# EAGLE design led-matrix-cape (EAGLE 6.6.0)

## Sheet 1 of 5
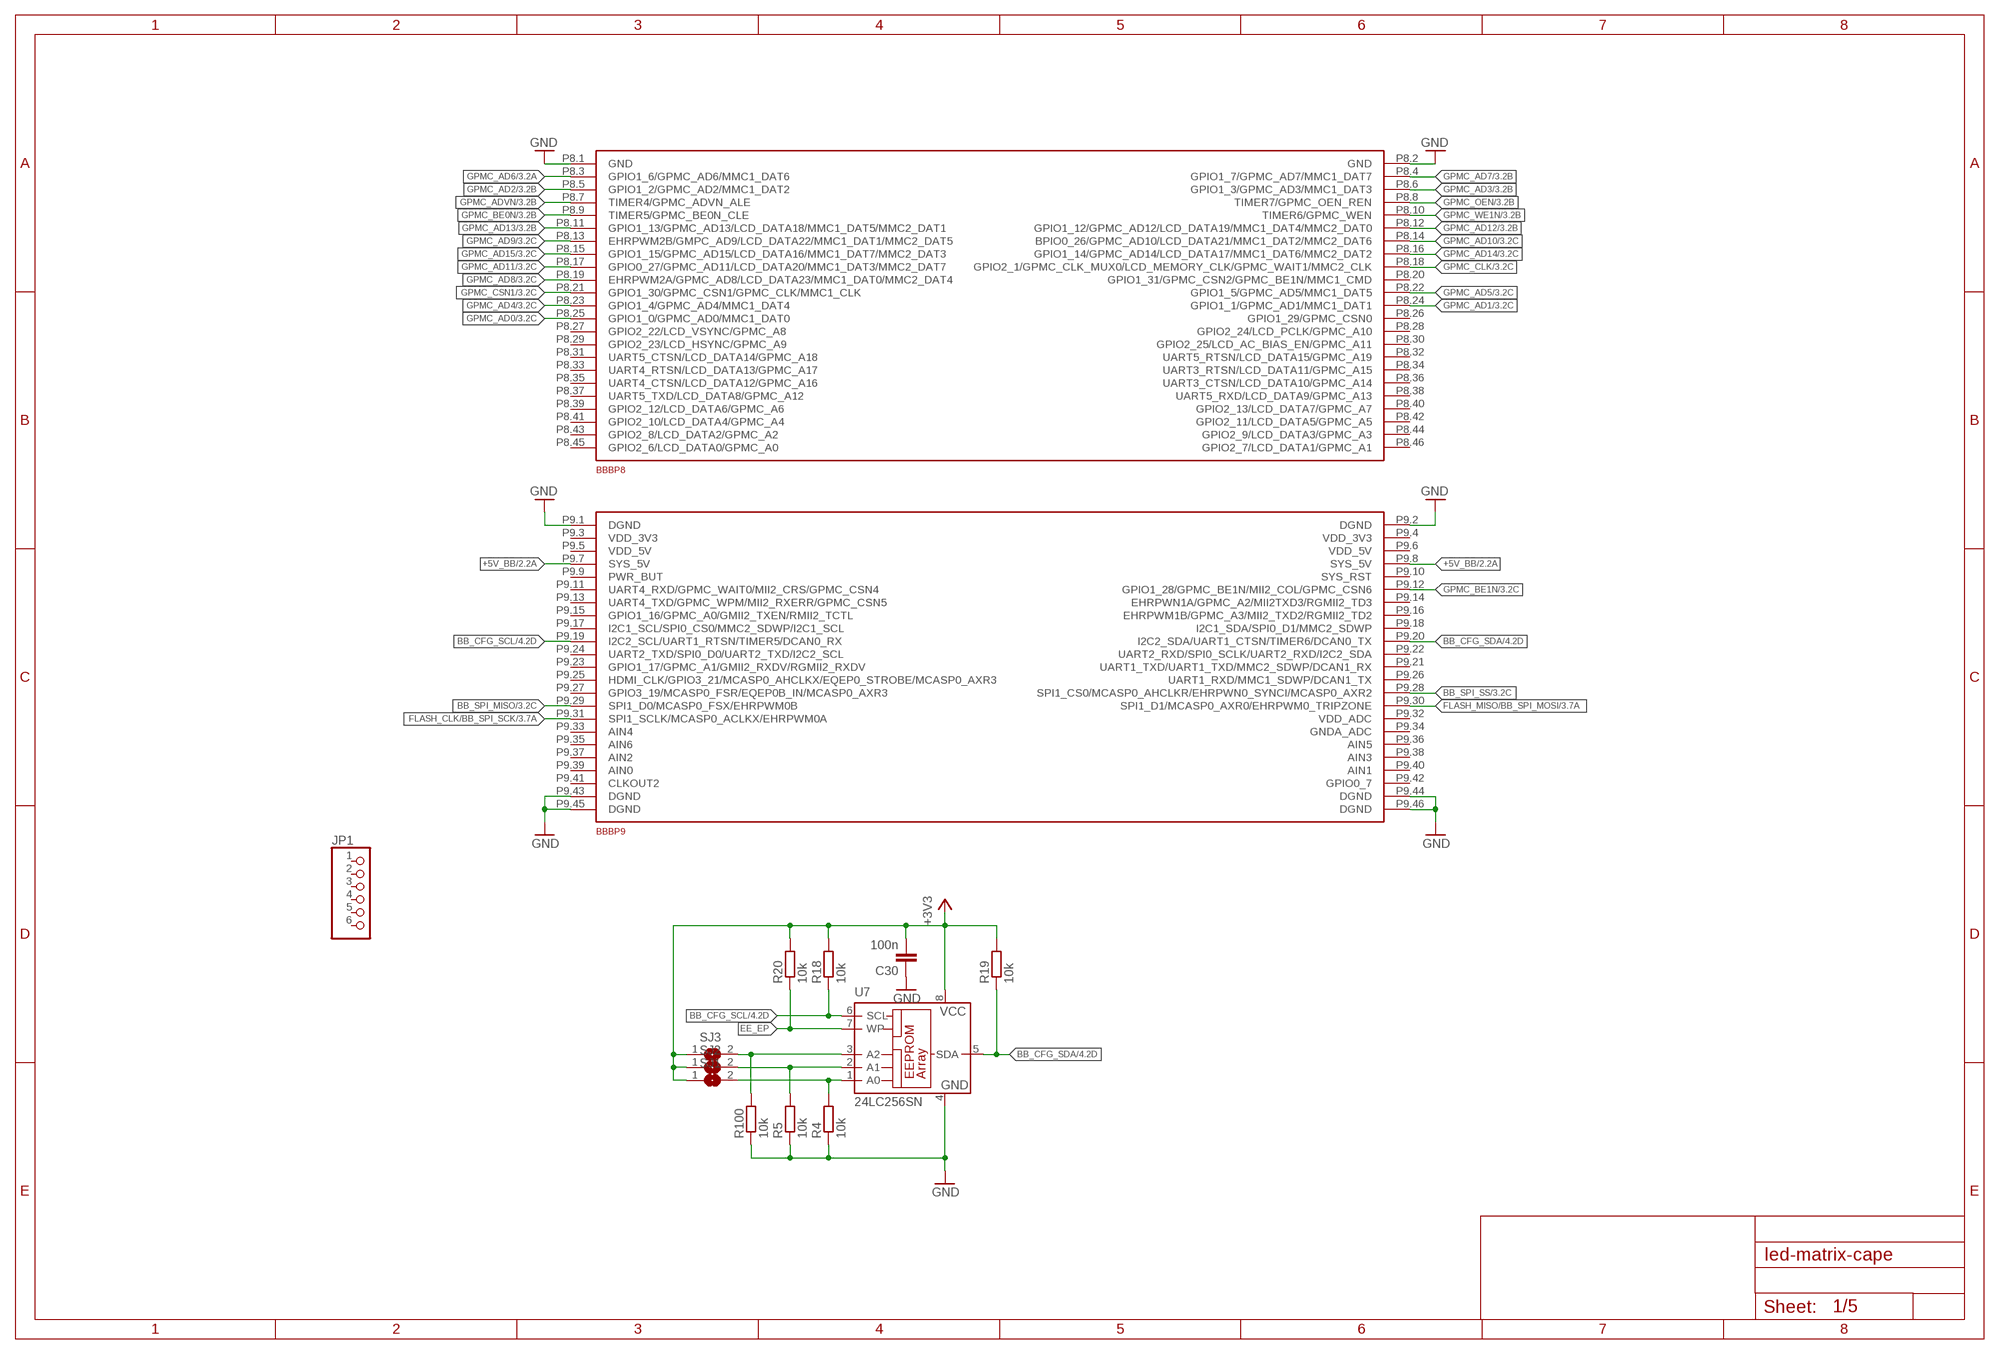
[diagram p0: schematic, sheet 1]

### Parts
BBB  BEAGLEBONE_CAPE_CONNECTORS  [BEAGLEBONE_CAPE]
C30  100n  C-EUC0603  [C0603]
JP1  PINHD-1X6  [1X06]
R4  10k  R-EU_R0603  [R0603]
R5  10k  R-EU_R0603  [R0603]
R18  10k  R-EU_R0603  [R0603]
R19  10k  R-EU_R0603  [R0603]
R20  10k  R-EU_R0603  [R0603]
R100  10k  R-EU_R0603  [R0603]
SJ1  SJ  [SJ]
SJ2  SJ  [SJ]
SJ3  SJ  [SJ]
U7  24LC256SN  [SO-08]

### Nets
+3V3: C30.2 R18.2 R19.2 R20.2 SJ1.1 SJ2.1 SJ3.1 U7.8(VCC) ; also sheet 2,3,4,5
+5V_BB: BBB.P9.7(P9:SYS_5V) BBB.P9.8(P9:SYS_5V) ; also sheet 2
ADDR0: R4.2 SJ1.2 U7.1(A0)
ADDR1: R5.2 SJ2.2 U7.2(A1)
ADDR2: R100.2 SJ3.2 U7.3(A2)
BB_CFG_SCL: BBB.P9.19(P9:I2C2_SCL/UART1_RTSN/TIMER5/DCAN0_RX) R18.1 U7.6(SCL) ; also sheet 4
BB_CFG_SDA: BBB.P9.20(P9:I2C2_SDA/UART1_CTSN/TIMER6/DCAN0_TX) R19.1 U7.5(SDA) ; also sheet 4
BB_SPI_MISO: BBB.P9.29(P9:SPI1_D0/MCASP0_FSX/EHRPWM0B) ; also sheet 3
BB_SPI_SS: BBB.P9.28(P9:SPI1_CS0/MCASP0_AHCLKR/EHRPWN0_SYNCI/MCASP0_AXR2) ; also sheet 3
EE_EP: R20.1 U7.7(WP)
FLASH_CLK/BB_SPI_SCK: BBB.P9.31(P9:SPI1_SCLK/MCASP0_ACLKX/EHRPWM0A) ; also sheet 3,4
FLASH_MISO/BB_SPI_MOSI: BBB.P9.30(P9:SPI1_D1/MCASP0_AXR0/EHRPWM0_TRIPZONE) ; also sheet 3,4
GND: BBB.P8.1(P8:GND) BBB.P8.2(P8:GND) BBB.P9.1(P9:DGND) BBB.P9.2(P9:DGND) BBB.P9.43(P9:DGND) BBB.P9.44(P9:DGND) BBB.P9.45(P9:DGND) BBB.P9.46(P9:DGND) C30.1 R4.1 R5.1 R100.1 U7.4(GND) ; also sheet 2,3,4,5
GPMC_AD0: BBB.P8.25(P8:GPIO1_0/GPMC_AD0/MMC1_DAT0) ; also sheet 3
GPMC_AD1: BBB.P8.24(P8:GPIO1_1/GPMC_AD1/MMC1_DAT1) ; also sheet 3
GPMC_AD2: BBB.P8.5(P8:GPIO1_2/GPMC_AD2/MMC1_DAT2) ; also sheet 3
GPMC_AD3: BBB.P8.6(P8:GPIO1_3/GPMC_AD3/MMC1_DAT3) ; also sheet 3
GPMC_AD4: BBB.P8.23(P8:GPIO1_4/GPMC_AD4/MMC1_DAT4) ; also sheet 3
GPMC_AD5: BBB.P8.22(P8:GPIO1_5/GPMC_AD5/MMC1_DAT5) ; also sheet 3
GPMC_AD6: BBB.P8.3(P8:GPIO1_6/GPMC_AD6/MMC1_DAT6) ; also sheet 3
GPMC_AD7: BBB.P8.4(P8:GPIO1_7/GPMC_AD7/MMC1_DAT7) ; also sheet 3
GPMC_AD8: BBB.P8.19(P8:EHRPWM2A/GPMC_AD8/LCD_DATA23/MMC1_DAT0/MMC2_DAT4) ; also sheet 3
GPMC_AD9: BBB.P8.13(P8:EHRPWM2B/GMPC_AD9/LCD_DATA22/MMC1_DAT1/MMC2_DAT5) ; also sheet 3
GPMC_AD10: BBB.P8.14(P8:BPIO0_26/GPMC_AD10/LCD_DATA21/MMC1_DAT2/MMC2_DAT6) ; also sheet 3
GPMC_AD11: BBB.P8.17(P8:GPIO0_27/GPMC_AD11/LCD_DATA20/MMC1_DAT3/MMC2_DAT7) ; also sheet 3
GPMC_AD12: BBB.P8.12(P8:GPIO1_12/GPMC_AD12/LCD_DATA19/MMC1_DAT4/MMC2_DAT0) ; also sheet 3
GPMC_AD13: BBB.P8.11(P8:GPIO1_13/GPMC_AD13/LCD_DATA18/MMC1_DAT5/MMC2_DAT1) ; also sheet 3
GPMC_AD14: BBB.P8.16(P8:GPIO1_14/GPMC_AD14/LCD_DATA17/MMC1_DAT6/MMC2_DAT2) ; also sheet 3
GPMC_AD15: BBB.P8.15(P8:GPIO1_15/GPMC_AD15/LCD_DATA16/MMC1_DAT7/MMC2_DAT3) ; also sheet 3
GPMC_ADVN: BBB.P8.7(P8:TIMER4/GPMC_ADVN_ALE) ; also sheet 3
GPMC_BE0N: BBB.P8.9(P8:TIMER5/GPMC_BE0N_CLE) ; also sheet 3
GPMC_BE1N: BBB.P9.12(P9:GPIO1_28/GPMC_BE1N/MII2_COL/GPMC_CSN6) ; also sheet 3
GPMC_CLK: BBB.P8.18(P8:GPIO2_1/GPMC_CLK_MUX0/LCD_MEMORY_CLK/GPMC_WAIT1/MMC2_CLK) ; also sheet 3
GPMC_CSN1: BBB.P8.21(P8:GPIO1_30/GPMC_CSN1/GPMC_CLK/MMC1_CLK) ; also sheet 3
GPMC_OEN: BBB.P8.8(P8:TIMER7/GPMC_OEN_REN) ; also sheet 3
GPMC_WE1N: BBB.P8.10(P8:TIMER6/GPMC_WEN) ; also sheet 3
Unconnected: BBB.P8.20(P8:GPIO1_31/GPMC_CSN2/GPMC_BE1N/MMC1_CMD) BBB.P8.26(P8:GPIO1_29/GPMC_CSN0) BBB.P8.27(P8:GPIO2_22/LCD_VSYNC/GPMC_A8) BBB.P8.28(P8:GPIO2_24/LCD_PCLK/GPMC_A10) BBB.P8.29(P8:GPIO2_23/LCD_HSYNC/GPMC_A9) BBB.P8.30(P8:GPIO2_25/LCD_AC_BIAS_EN/GPMC_A11) BBB.P8.31(P8:UART5_CTSN/LCD_DATA14/GPMC_A18) BBB.P8.32(P8:UART5_RTSN/LCD_DATA15/GPMC_A19) BBB.P8.33(P8:UART4_RTSN/LCD_DATA13/GPMC_A17) BBB.P8.34(P8:UART3_RTSN/LCD_DATA11/GPMC_A15) BBB.P8.35(P8:UART4_CTSN/LCD_DATA12/GPMC_A16) BBB.P8.36(P8:UART3_CTSN/LCD_DATA10/GPMC_A14) BBB.P8.37(P8:UART5_TXD/LCD_DATA8/GPMC_A12) BBB.P8.38(P8:UART5_RXD/LCD_DATA9/GPMC_A13) BBB.P8.39(P8:GPIO2_12/LCD_DATA6/GPMC_A6) BBB.P8.40(P8:GPIO2_13/LCD_DATA7/GPMC_A7) BBB.P8.41(P8:GPIO2_10/LCD_DATA4/GPMC_A4) BBB.P8.42(P8:GPIO2_11/LCD_DATA5/GPMC_A5) BBB.P8.43(P8:GPIO2_8/LCD_DATA2/GPMC_A2) BBB.P8.44(P8:GPIO2_9/LCD_DATA3/GPMC_A3) BBB.P8.45(P8:GPIO2_6/LCD_DATA0/GPMC_A0) BBB.P8.46(P8:GPIO2_7/LCD_DATA1/GPMC_A1) BBB.P9.3(P9:VDD_3V3) BBB.P9.4(P9:VDD_3V3) BBB.P9.5(P9:VDD_5V) BBB.P9.6(P9:VDD_5V) BBB.P9.9(P9:PWR_BUT) BBB.P9.10(P9:SYS_RST) BBB.P9.11(P9:UART4_RXD/GPMC_WAIT0/MII2_CRS/GPMC_CSN4) BBB.P9.13(P9:UART4_TXD/GPMC_WPM/MII2_RXERR/GPMC_CSN5) BBB.P9.14(P9:EHRPWN1A/GPMC_A2/MII2TXD3/RGMII2_TD3) BBB.P9.15(P9:GPIO1_16/GPMC_A0/GMII2_TXEN/RMII2_TCTL) BBB.P9.16(P9:EHRPWM1B/GPMC_A3/MII2_TXD2/RGMII2_TD2) BBB.P9.17(P9:I2C1_SCL/SPI0_CS0/MMC2_SDWP/I2C1_SCL) BBB.P9.18(P9:I2C1_SDA/SPI0_D1/MMC2_SDWP) BBB.P9.21(P9:UART1_TXD/UART1_TXD/MMC2_SDWP/DCAN1_RX) BBB.P9.22(P9:UART2_RXD/SPI0_SCLK/UART2_RXD/I2C2_SDA) BBB.P9.23(P9:GPIO1_17/GPMC_A1/GMII2_RXDV/RGMII2_RXDV) BBB.P9.24(P9:UART2_TXD/SPI0_D0/UART2_TXD/I2C2_SCL) BBB.P9.25(P9:HDMI_CLK/GPIO3_21/MCASP0_AHCLKX/EQEP0_STROBE/MCASP0_AXR3) BBB.P9.26(P9:UART1_RXD/MMC1_SDWP/DCAN1_TX) BBB.P9.27(P9:GPIO3_19/MCASP0_FSR/EQEP0B_IN/MCASP0_AXR3) BBB.P9.32(P9:VDD_ADC) BBB.P9.33(P9:AIN4) BBB.P9.34(P9:GNDA_ADC) BBB.P9.35(P9:AIN6) BBB.P9.36(P9:AIN5) BBB.P9.37(P9:AIN2) BBB.P9.38(P9:AIN3) BBB.P9.39(P9:AIN0) BBB.P9.40(P9:AIN1) BBB.P9.41(P9:CLKOUT2) BBB.P9.42(P9:GPIO0_7) JP1.1 JP1.2 JP1.3 JP1.4 JP1.5 JP1.6

## Sheet 2 of 5
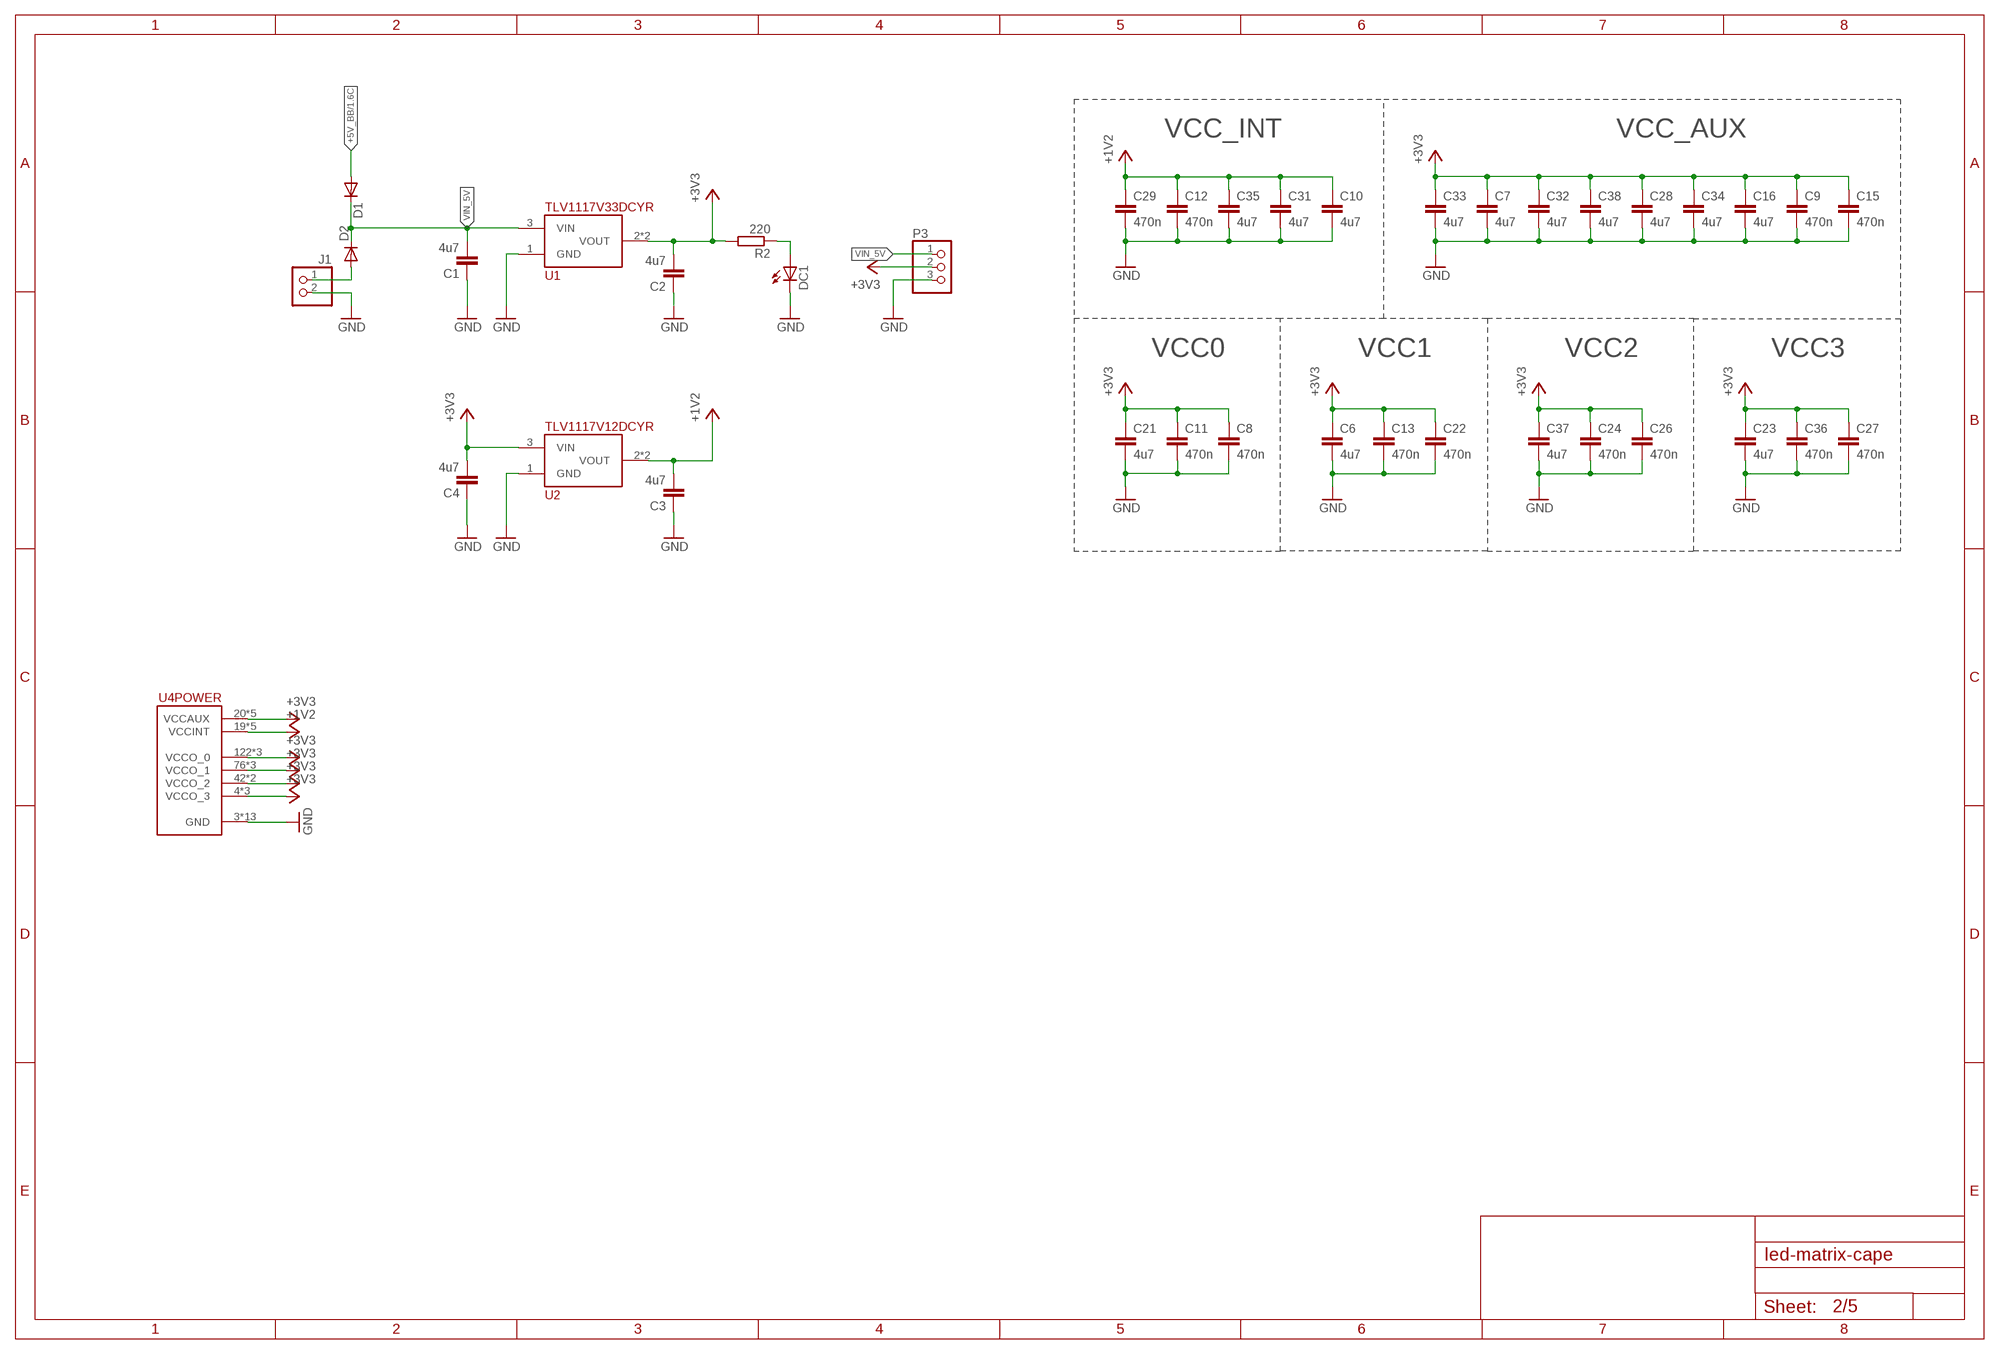
[diagram p1: schematic, sheet 2]

### Parts
C1  4u7  C-EUC0603  [C0603]
C2  4u7  C-EUC0603  [C0603]
C3  4u7  C-EUC0603  [C0603]
C4  4u7  C-EUC0603  [C0603]
C6  4u7  C-EUC0603  [C0603]
C7  4u7  C-EUC0603  [C0603]
C8  470n  C-EUC0603  [C0603]
C9  470n  C-EUC0603  [C0603]
C10  4u7  C-EUC0603  [C0603]
C11  470n  C-EUC0603  [C0603]
C12  470n  C-EUC0603  [C0603]
C13  470n  C-EUC0603  [C0603]
C15  470n  C-EUC0603  [C0603]
C16  4u7  C-EUC0603  [C0603]
C21  4u7  C-EUC0603  [C0603]
C22  470n  C-EUC0603  [C0603]
C23  4u7  C-EUC0603  [C0603]
C24  470n  C-EUC0603  [C0603]
C26  470n  C-EUC0603  [C0603]
C27  470n  C-EUC0603  [C0603]
C28  4u7  C-EUC0603  [C0603]
C29  470n  C-EUC0603  [C0603]
C31  4u7  C-EUC0603  [C0603]
C32  4u7  C-EUC0603  [C0603]
C33  4u7  C-EUC0603  [C0603]
C34  4u7  C-EUC0603  [C0603]
C35  4u7  C-EUC0603  [C0603]
C36  470n  C-EUC0603  [C0603]
C37  4u7  C-EUC0603  [C0603]
C38  4u7  C-EUC0603  [C0603]
D1  DIODE-SOD123  [SOD123]
D2  DIODE-SOD123  [SOD123]
DC1  LEDCHIP-LED0805  [CHIP-LED0805]
J1  PINHD-1X2  [1X02]
P3  PINHD-1X3  [1X03]
R2  220  R-EU_R0805  [R0805]
U1  TLV1117V33DCYR  TLV1117V  [SOT223]
U2  TLV1117V12DCYR  TLV1117V  [SOT223]
U4  XC6SLX9-2TQG144C  [TQFP144]

### Nets
+1V2: C3.2 C10.1 C12.1 C29.1 C31.1 C35.1 U2.2(VOUT) U2.4(VOUT) U4.19(POWER:VCCINT) U4.28(POWER:VCCINT) U4.52(POWER:VCCINT) U4.89(POWER:VCCINT) U4.128(POWER:VCCINT)
+3V3: C2.2 C4.2 C6.1 C7.1 C8.1 C9.1 C11.1 C13.1 C15.1 C16.1 C21.1 C22.1 C23.1 C24.1 C26.1 C27.1 C28.1 C32.1 C33.1 C34.1 C36.1 C37.1 C38.1 P3.2 R2.2 U1.2(VOUT) U1.4(VOUT) U2.3(VIN) U4.4(POWER:VCCO_3) U4.18(POWER:VCCO_3) U4.20(POWER:VCCAUX) U4.31(POWER:VCCO_3) U4.36(POWER:VCCAUX) U4.42(POWER:VCCO_2) U4.53(POWER:VCCAUX) U4.63(POWER:VCCO_2) U4.76(POWER:VCCO_1) U4.86(POWER:VCCO_1) U4.90(POWER:VCCAUX) U4.103(POWER:VCCO_1) U4.122(POWER:VCCO_0) U4.125(POWER:VCCO_0) U4.129(POWER:VCCAUX) U4.135(POWER:VCCO_0) ; also sheet 1,3,4,5
+5V_BB: D1.A ; also sheet 1
GND: C1.1 C2.1 C3.1 C4.1 C6.2 C7.2 C8.2 C9.2 C10.2 C11.2 C12.2 C13.2 C15.2 C16.2 C21.2 C22.2 C23.2 C24.2 C26.2 C27.2 C28.2 C29.2 C31.2 C32.2 C33.2 C34.2 C35.2 C36.2 C37.2 C38.2 DC1.C J1.2 P3.3 U1.1(GND) U2.1(GND) U4.3(POWER:GND) U4.13(POWER:GND) U4.25(POWER:GND) U4.49(POWER:GND) U4.54(POWER:GND) U4.68(POWER:GND) U4.77(POWER:GND) U4.91(POWER:GND) U4.96(POWER:GND) U4.108(POWER:GND) U4.113(POWER:GND) U4.130(POWER:GND) U4.136(POWER:GND) ; also sheet 1,3,4,5
N$4: D2.A J1.1
N$5: DC1.A R2.1
VIN_5V: C1.2 D1.C D2.C P3.1 U1.3(VIN)

### Notes on the sheet
- VCC_INT | VCC_AUX
- VCC0 | VCC1 | VCC2 | VCC3

## Sheet 3 of 5
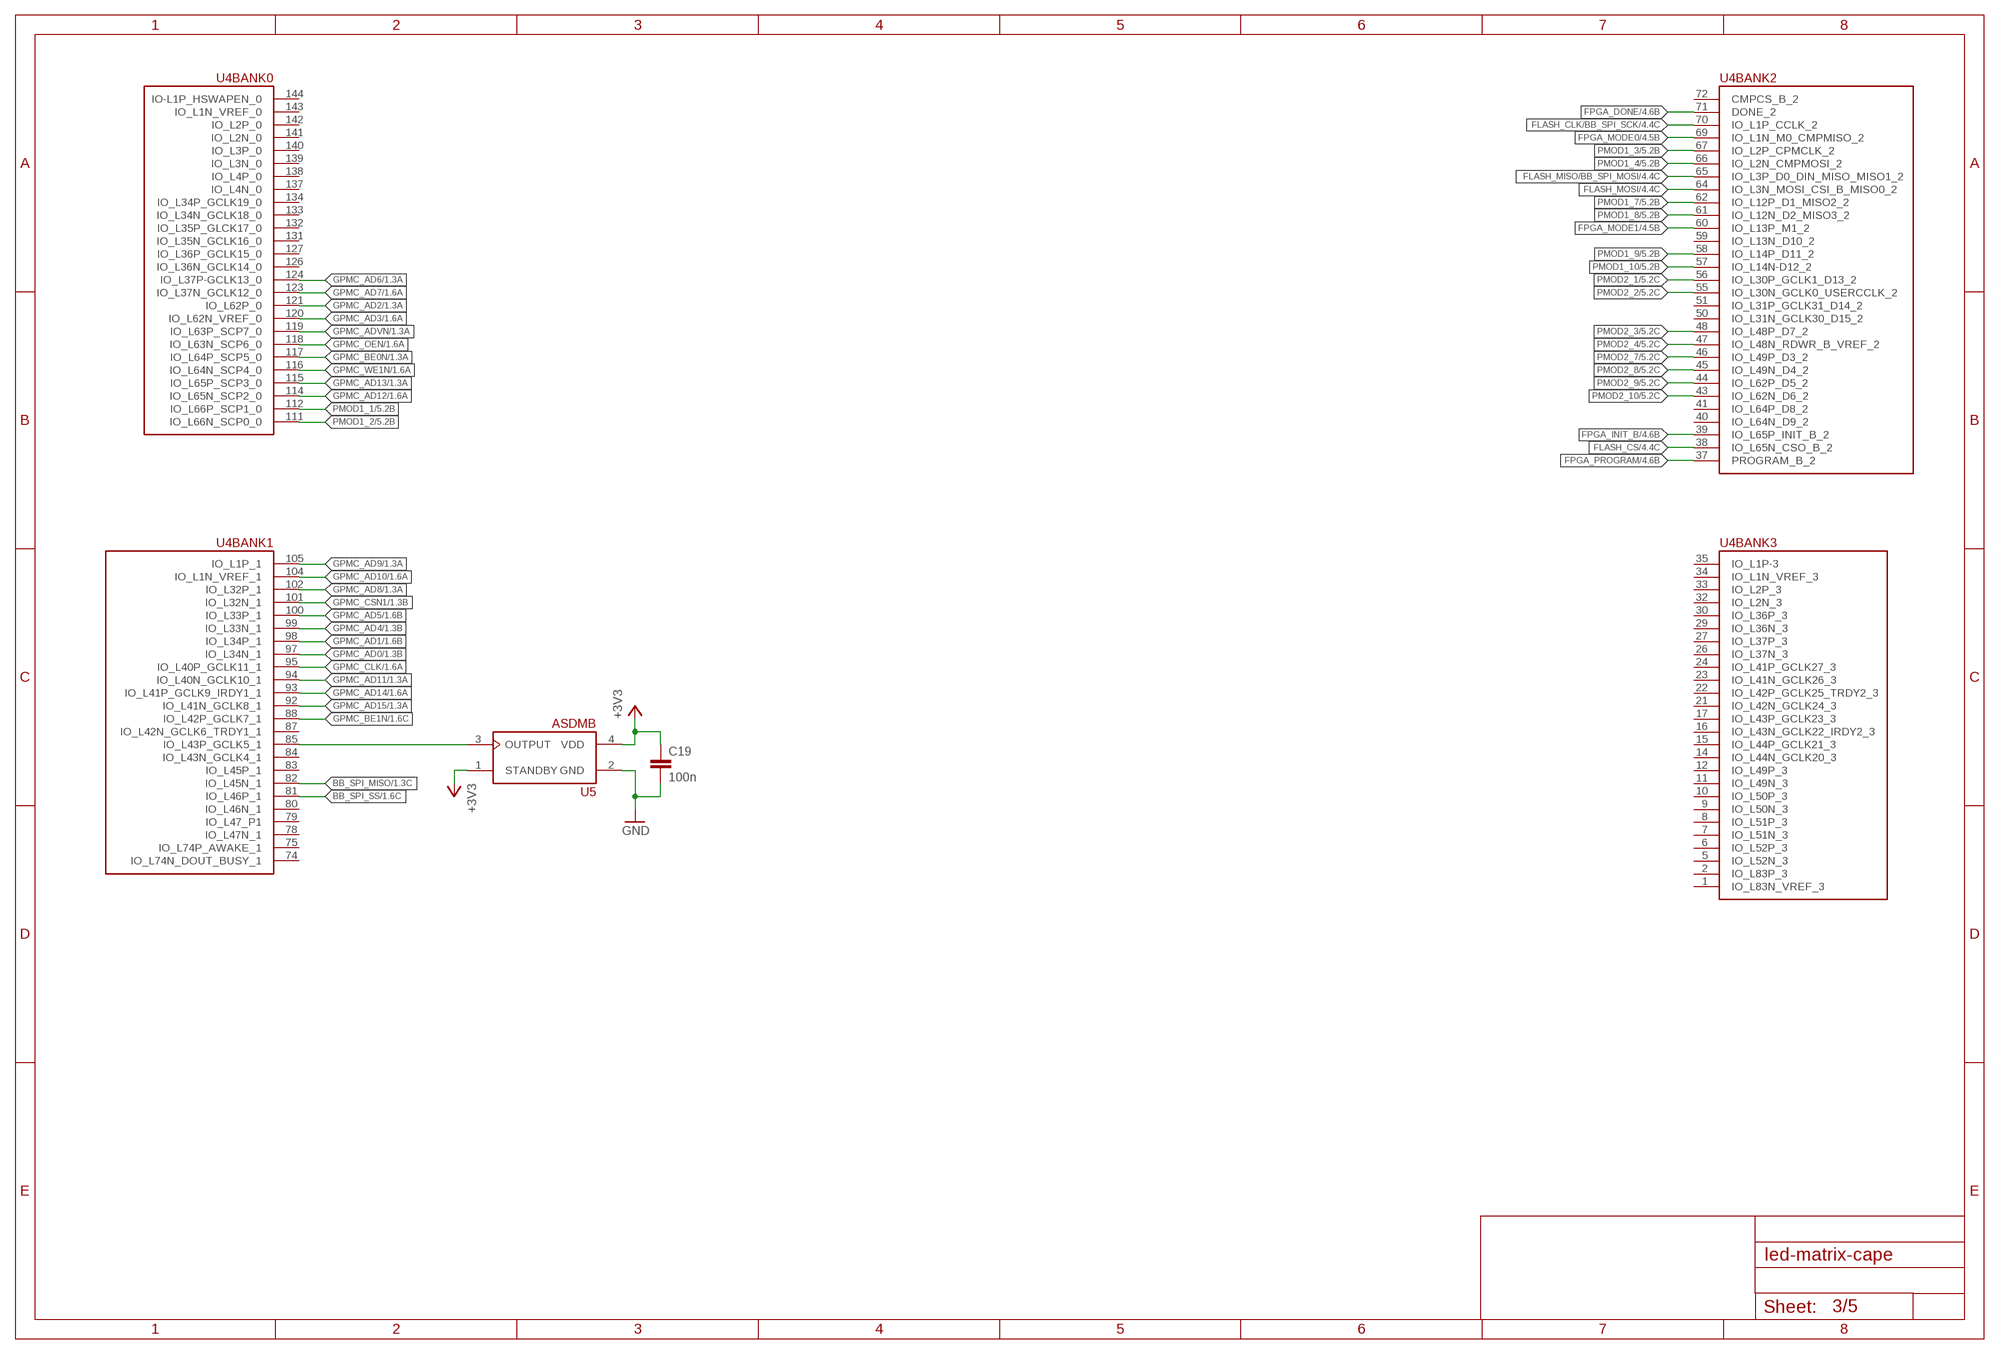
[diagram p2: schematic, sheet 3]

### Parts
C19  100n  C-EUC0603  [C0603]
U5  ASDMB  [ASDMB]

### Nets
+3V3: C19.1 U5.1(STANDBY) U5.4(VDD) ; also sheet 1,2,4,5
BB_SPI_MISO: U4.82(BANK1:IO_L45N_1) ; also sheet 1
BB_SPI_SS: U4.81(BANK1:IO_L46P_1) ; also sheet 1
FLASH_CLK/BB_SPI_SCK: U4.70(BANK2:IO_L1P_CCLK_2) ; also sheet 1,4
FLASH_CS: U4.38(BANK2:IO_L65N_CSO_B_2) ; also sheet 4
FLASH_MISO/BB_SPI_MOSI: U4.65(BANK2:IO_L3P_D0_DIN_MISO_MISO1_2) ; also sheet 1,4
FLASH_MOSI: U4.64(BANK2:IO_L3N_MOSI_CSI_B_MISO0_2) ; also sheet 4
FPGA_DONE: U4.71(BANK2:DONE_2) ; also sheet 4
FPGA_INIT_B: U4.39(BANK2:IO_L65P_INIT_B_2) ; also sheet 4
FPGA_MODE0: U4.69(BANK2:IO_L1N_M0_CMPMISO_2) ; also sheet 4
FPGA_MODE1: U4.60(BANK2:IO_L13P_M1_2) ; also sheet 4
FPGA_PROGRAM: U4.37(BANK2:PROGRAM_B_2) ; also sheet 4
GND: C19.2 U5.2(GND) ; also sheet 1,2,4,5
GPMC_AD0: U4.97(BANK1:IO_L34N_1) ; also sheet 1
GPMC_AD1: U4.98(BANK1:IO_L34P_1) ; also sheet 1
GPMC_AD2: U4.121(BANK0:IO_L62P_0) ; also sheet 1
GPMC_AD3: U4.120(BANK0:IO_L62N_VREF_0) ; also sheet 1
GPMC_AD4: U4.99(BANK1:IO_L33N_1) ; also sheet 1
GPMC_AD5: U4.100(BANK1:IO_L33P_1) ; also sheet 1
GPMC_AD6: U4.124(BANK0:IO_L37P-GCLK13_0) ; also sheet 1
GPMC_AD7: U4.123(BANK0:IO_L37N_GCLK12_0) ; also sheet 1
GPMC_AD8: U4.102(BANK1:IO_L32P_1) ; also sheet 1
GPMC_AD9: U4.105(BANK1:IO_L1P_1) ; also sheet 1
GPMC_AD10: U4.104(BANK1:IO_L1N_VREF_1) ; also sheet 1
GPMC_AD11: U4.94(BANK1:IO_L40N_GCLK10_1) ; also sheet 1
GPMC_AD12: U4.114(BANK0:IO_L65N_SCP2_0) ; also sheet 1
GPMC_AD13: U4.115(BANK0:IO_L65P_SCP3_0) ; also sheet 1
GPMC_AD14: U4.93(BANK1:IO_L41P_GCLK9_IRDY1_1) ; also sheet 1
GPMC_AD15: U4.92(BANK1:IO_L41N_GCLK8_1) ; also sheet 1
GPMC_ADVN: U4.119(BANK0:IO_L63P_SCP7_0) ; also sheet 1
GPMC_BE0N: U4.117(BANK0:IO_L64P_SCP5_0) ; also sheet 1
GPMC_BE1N: U4.88(BANK1:IO_L42P_GCLK7_1) ; also sheet 1
GPMC_CLK: U4.95(BANK1:IO_L40P_GCLK11_1) ; also sheet 1
GPMC_CSN1: U4.101(BANK1:IO_L32N_1) ; also sheet 1
GPMC_OEN: U4.118(BANK0:IO_L63N_SCP6_0) ; also sheet 1
GPMC_WE1N: U4.116(BANK0:IO_L64N_SCP4_0) ; also sheet 1
OSC_FPGA: U4.85(BANK1:IO_L43P_GCLK5_1) U5.3(OUTPUT)
PMOD1_1: U4.112(BANK0:IO_L66P_SCP1_0) ; also sheet 5
PMOD1_2: U4.111(BANK0:IO_L66N_SCP0_0) ; also sheet 5
PMOD1_3: U4.67(BANK2:IO_L2P_CPMCLK_2) ; also sheet 5
PMOD1_4: U4.66(BANK2:IO_L2N_CMPMOSI_2) ; also sheet 5
PMOD1_7: U4.62(BANK2:IO_L12P_D1_MISO2_2) ; also sheet 5
PMOD1_8: U4.61(BANK2:IO_L12N_D2_MISO3_2) ; also sheet 5
PMOD1_9: U4.58(BANK2:IO_L14P_D11_2) ; also sheet 5
PMOD1_10: U4.57(BANK2:IO_L14N-D12_2) ; also sheet 5
PMOD2_1: U4.56(BANK2:IO_L30P_GCLK1_D13_2) ; also sheet 5
PMOD2_2: U4.55(BANK2:IO_L30N_GCLK0_USERCCLK_2) ; also sheet 5
PMOD2_3: U4.48(BANK2:IO_L48P_D7_2) ; also sheet 5
PMOD2_4: U4.47(BANK2:IO_L48N_RDWR_B_VREF_2) ; also sheet 5
PMOD2_7: U4.46(BANK2:IO_L49P_D3_2) ; also sheet 5
PMOD2_8: U4.45(BANK2:IO_L49N_D4_2) ; also sheet 5
PMOD2_9: U4.44(BANK2:IO_L62P_D5_2) ; also sheet 5
PMOD2_10: U4.43(BANK2:IO_L62N_D6_2) ; also sheet 5
Unconnected: U4.1(BANK3:IO_L83N_VREF_3) U4.2(BANK3:IO_L83P_3) U4.5(BANK3:IO_L52N_3) U4.6(BANK3:IO_L52P_3) U4.7(BANK3:IO_L51N_3) U4.8(BANK3:IO_L51P_3) U4.9(BANK3:IO_L50N_3) U4.10(BANK3:IO_L50P_3) U4.11(BANK3:IO_L49N_3) U4.12(BANK3:IO_L49P_3) U4.14(BANK3:IO_L44N_GCLK20_3) U4.15(BANK3:IO_L44P_GCLK21_3) U4.16(BANK3:IO_L43N_GCLK22_IRDY2_3) U4.17(BANK3:IO_L43P_GCLK23_3) U4.21(BANK3:IO_L42N_GCLK24_3) U4.22(BANK3:IO_L42P_GCLK25_TRDY2_3) U4.23(BANK3:IO_L41N_GCLK26_3) U4.24(BANK3:IO_L41P_GCLK27_3) U4.26(BANK3:IO_L37N_3) U4.27(BANK3:IO_L37P_3) U4.29(BANK3:IO_L36N_3) U4.30(BANK3:IO_L36P_3) U4.32(BANK3:IO_L2N_3) U4.33(BANK3:IO_L2P_3) U4.34(BANK3:IO_L1N_VREF_3) U4.35(BANK3:IO_L1P-3) U4.40(BANK2:IO_L64N_D9_2) U4.41(BANK2:IO_L64P_D8_2) U4.50(BANK2:IO_L31N_GCLK30_D15_2) U4.51(BANK2:IO_L31P_GCLK31_D14_2) U4.59(BANK2:IO_L13N_D10_2) U4.72(BANK2:CMPCS_B_2) U4.74(BANK1:IO_L74N_DOUT_BUSY_1) U4.75(BANK1:IO_L74P_AWAKE_1) U4.78(BANK1:IO_L47N_1) U4.79(BANK1:IO_L47_P1) U4.80(BANK1:IO_L46N_1) U4.83(BANK1:IO_L45P_1) U4.84(BANK1:IO_L43N_GCLK4_1) U4.87(BANK1:IO_L42N_GCLK6_TRDY1_1) U4.126(BANK0:IO_L36N_GCLK14_0) U4.127(BANK0:IO_L36P_GCLK15_0) U4.131(BANK0:IO_L35N_GCLK16_0) U4.132(BANK0:IO_L35P_GLCK17_0) U4.133(BANK0:IO_L34N_GCLK18_0) U4.134(BANK0:IO_L34P_GCLK19_0) U4.137(BANK0:IO_L4N_0) U4.138(BANK0:IO_L4P_0) U4.139(BANK0:IO_L3N_0) U4.140(BANK0:IO_L3P_0) U4.141(BANK0:IO_L2N_0) U4.142(BANK0:IO_L2P_0) U4.143(BANK0:IO_L1N_VREF_0) U4.144(BANK0:IO-L1P_HSWAPEN_0)

## Sheet 4 of 5
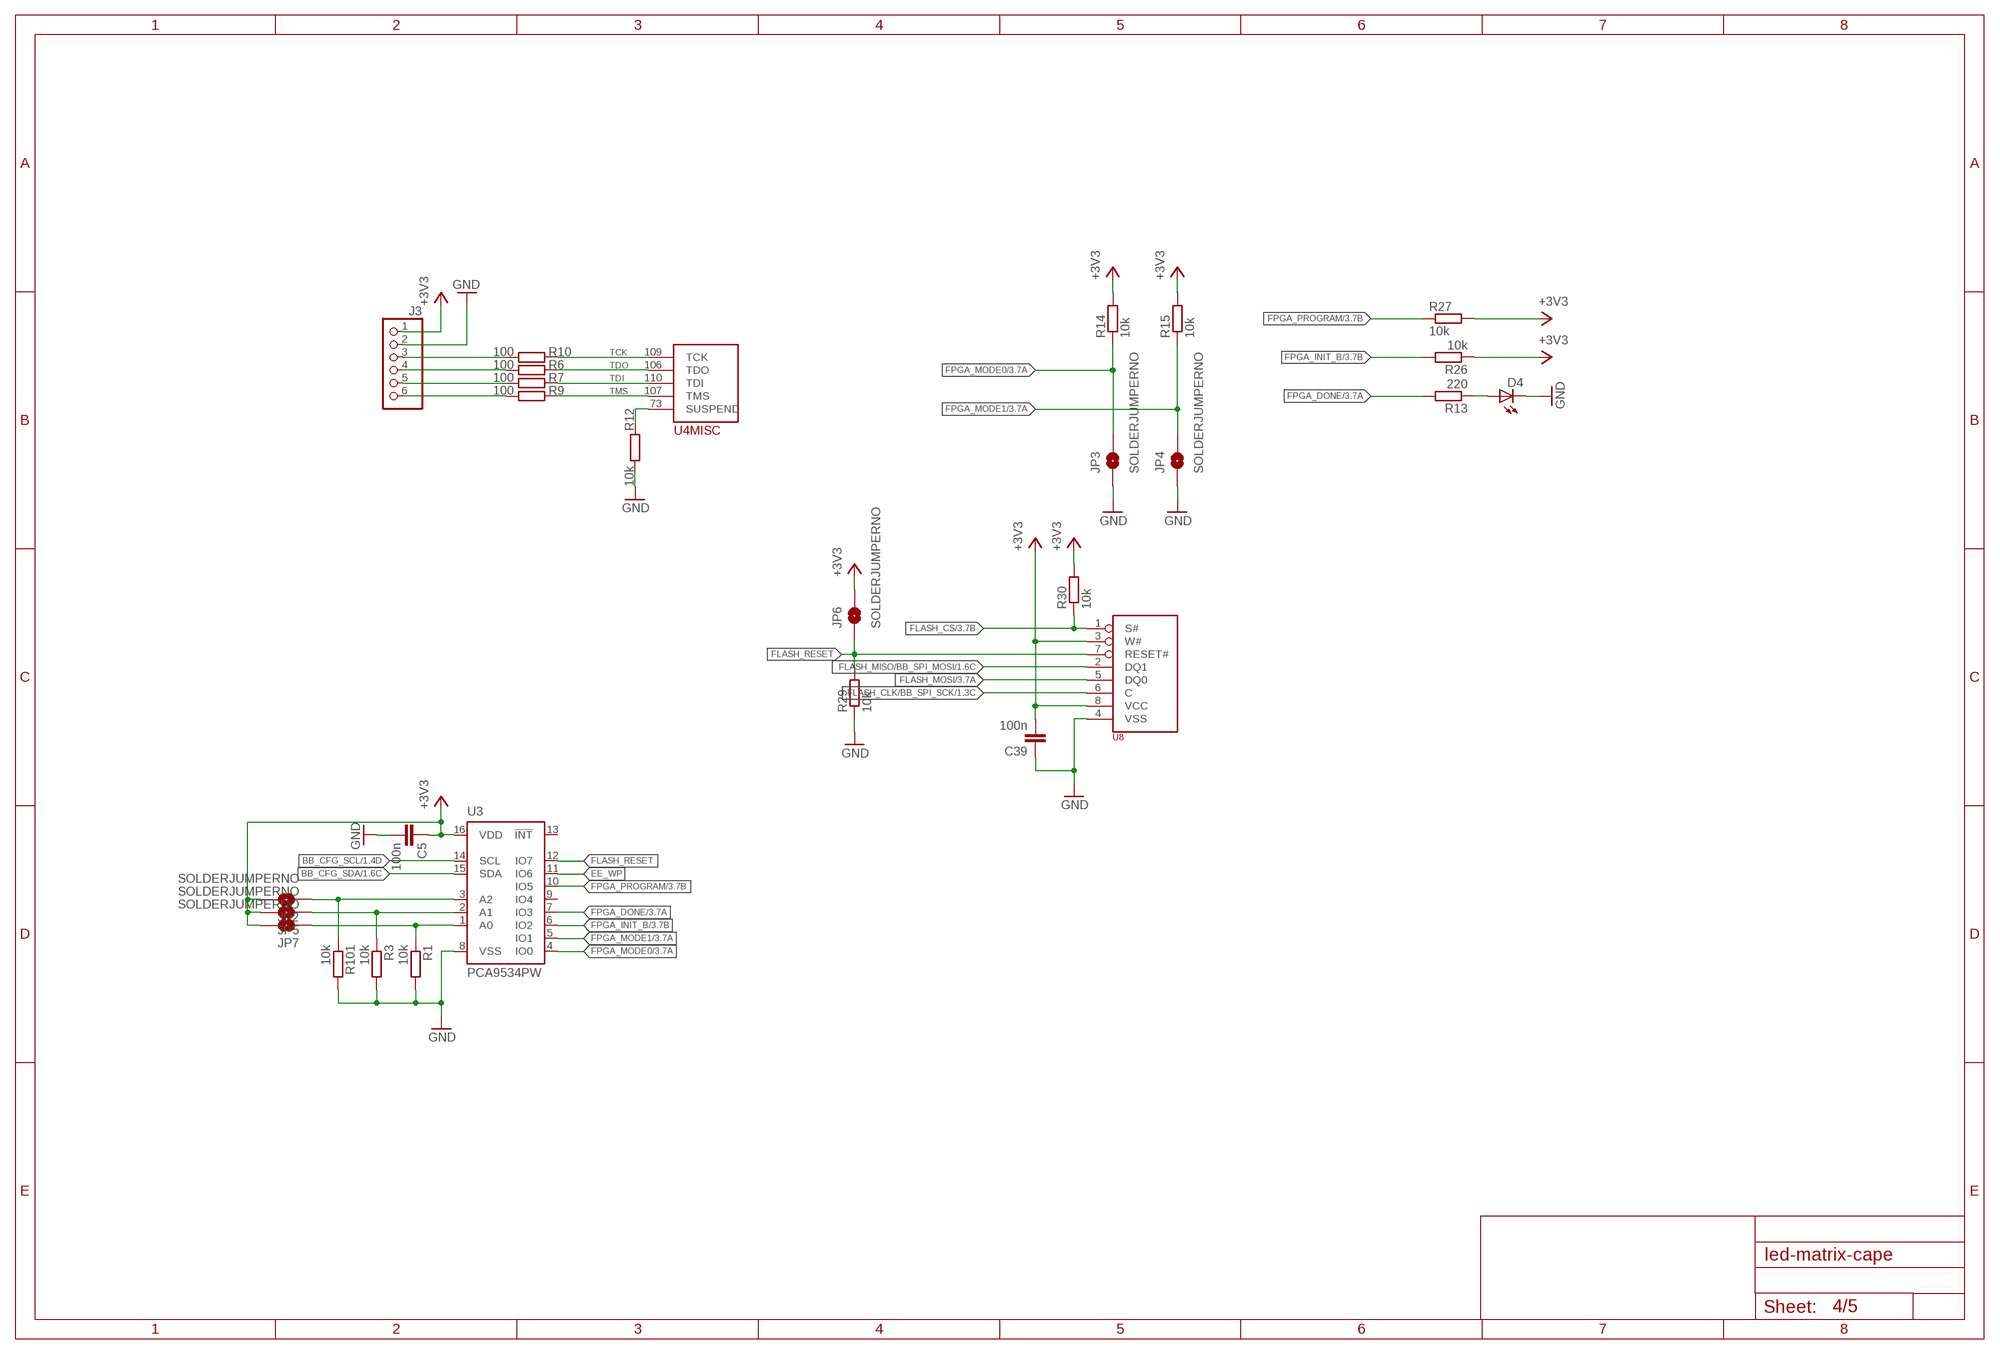
[diagram p3: schematic, sheet 4]

### Parts
C5  100n  C-EUC0603  [C0603]
C39  100n  C-EUC0603  [C0603]
D4  LEDCHIP-LED0805  [CHIP-LED0805]
J3  PINHD-1X6  [1X06]
JP2  SOLDERJUMPERNO  [SJ_2S-NO]
JP3  SOLDERJUMPERNO  [SJ_2S-NO]
JP4  SOLDERJUMPERNO  [SJ_2S-NO]
JP5  SOLDERJUMPERNO  [SJ_2S-NO]
JP6  SOLDERJUMPERNO  [SJ_2S-NO]
JP7  SOLDERJUMPERNO  [SJ_2S-NO]
R1  10k  R-EU_R0603  [R0603]
R3  10k  R-EU_R0603  [R0603]
R6  100  R-EU_R0603  [R0603]
R7  100  R-EU_R0603  [R0603]
R9  100  R-EU_R0603  [R0603]
R10  100  R-EU_R0603  [R0603]
R12  10k  R-EU_R0603  [R0603]
R13  220  R-EU_R0603  [R0603]
R14  10k  R-EU_R0603  [R0603]
R15  10k  R-EU_R0603  [R0603]
R26  10k  R-EU_R0603  [R0603]
R27  10k  R-EU_R0603  [R0603]
R29  10k  R-EU_R0805  [R0805]
R30  10k  R-EU_R0603  [R0603]
R101  10k  R-EU_R0603  [R0603]
U3  PCA9534PW  [TSSOP16]
U8  M25PE16  [SO8]

### Nets
+3V3: C5.1 C39.2 J3.1 JP2.2 JP5.2 JP6.2 JP7.2 R14.2 R15.2 R26.1 R27.2 R30.2 U3.16(VDD) U8.3(W#) U8.8(VCC) ; also sheet 1,2,3,5
BB_CFG_SCL: U3.14(SCL) ; also sheet 1
BB_CFG_SDA: U3.15(SDA) ; also sheet 1
EE_WP: U3.11(IO6)
FLASH_CLK/BB_SPI_SCK: U8.6(C) ; also sheet 1,3
FLASH_CS: R30.1 U8.1(S#) ; also sheet 3
FLASH_MISO/BB_SPI_MOSI: U8.2(DQ1) ; also sheet 1,3
FLASH_MOSI: U8.5(DQ0) ; also sheet 3
FLASH_RESET: JP6.1 R29.2 U3.12(IO7) U8.7(RESET#)
FPGA_DONE: R13.2 U3.7(IO3) ; also sheet 3
FPGA_INIT_B: R26.2 U3.6(IO2) ; also sheet 3
FPGA_MODE0: JP3.2 R14.1 U3.4(IO0) ; also sheet 3
FPGA_MODE1: JP4.2 R15.1 U3.5(IO1) ; also sheet 3
FPGA_PROGRAM: R27.1 U3.10(IO5) ; also sheet 3
GND: C5.2 C39.1 D4.C J3.2 JP3.1 JP4.1 R1.2 R3.2 R12.1 R29.1 R101.2 U3.8(VSS) U8.4(VSS) ; also sheet 1,2,3,5
N$1: JP7.1 R1.1 U3.1(A0)
N$2: JP5.1 R3.1 U3.2(A1)
N$3: JP2.1 R101.1 U3.3(A2)
N$6: J3.3 R10.1
N$7: J3.4 R6.1
N$8: J3.5 R7.1
N$9: J3.6 R9.1
N$11: D4.A R13.1
SUSPEND: R12.2 U4.73(MISC:SUSPEND)
TCK: R10.2 U4.109(MISC:TCK)
TDI: R7.2 U4.110(MISC:TDI)
TDO: R6.2 U4.106(MISC:TDO)
TMS: R9.2 U4.107(MISC:TMS)
Unconnected: U3.9(IO4) U3.13(!INT)

## Sheet 5 of 5
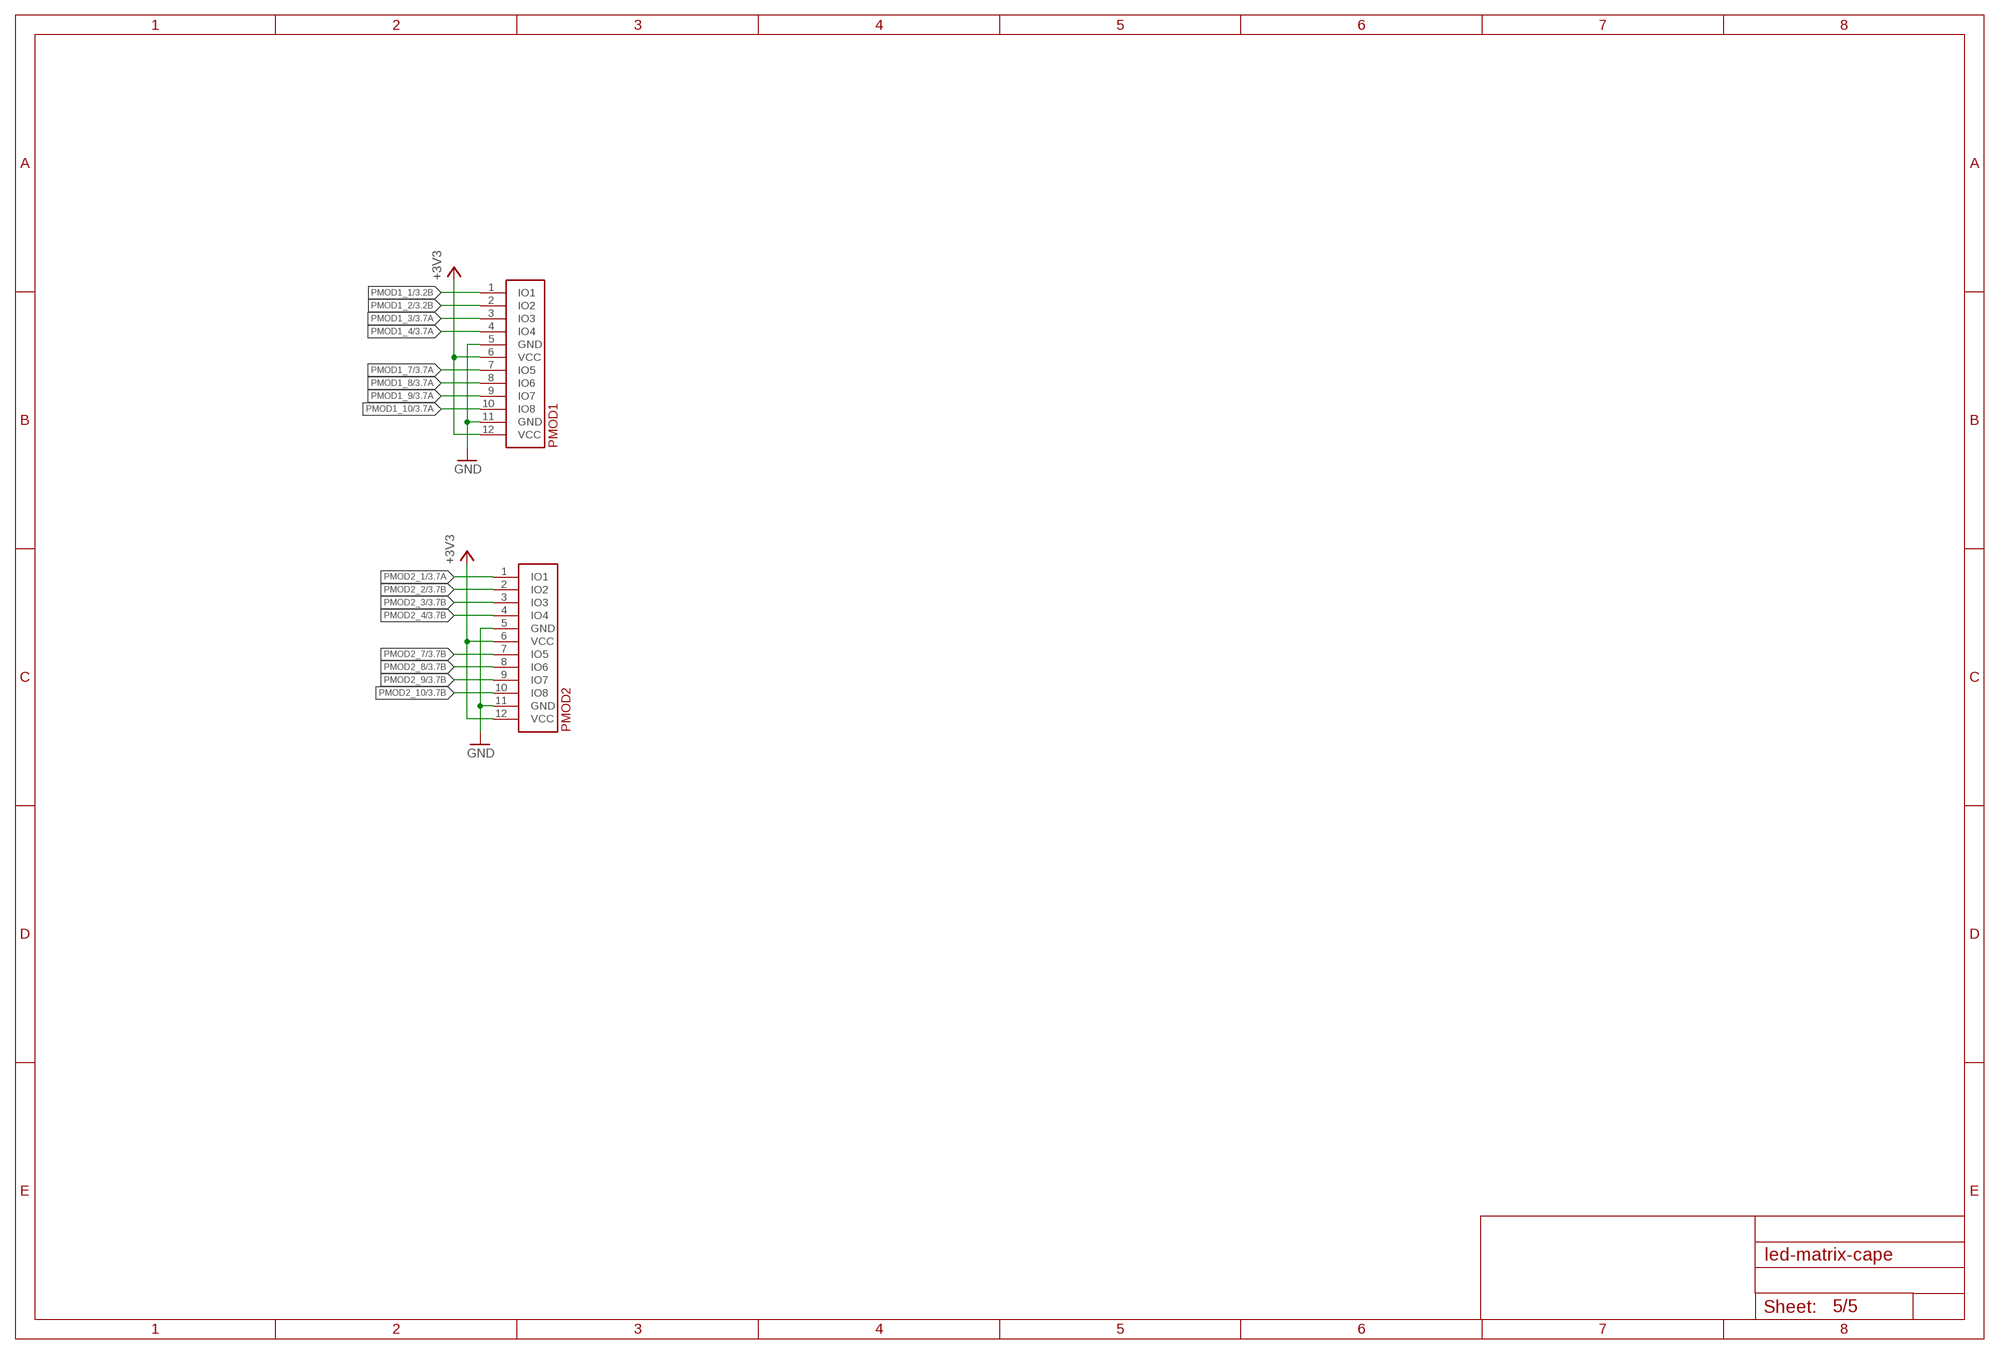
[diagram p4: schematic, sheet 5]

### Parts
PMOD1  PMOD_2_HOST  [PMOD_2_HOST]
PMOD2  PMOD_2_HOST  [PMOD_2_HOST]

### Nets
+3V3: PMOD1.6(VCC) PMOD1.12(VCC) PMOD2.6(VCC) PMOD2.12(VCC) ; also sheet 1,2,3,4
GND: PMOD1.5(GND) PMOD1.11(GND) PMOD2.5(GND) PMOD2.11(GND) ; also sheet 1,2,3,4
PMOD1_1: PMOD1.1(IO1) ; also sheet 3
PMOD1_2: PMOD1.2(IO2) ; also sheet 3
PMOD1_3: PMOD1.3(IO3) ; also sheet 3
PMOD1_4: PMOD1.4(IO4) ; also sheet 3
PMOD1_7: PMOD1.7(IO5) ; also sheet 3
PMOD1_8: PMOD1.8(IO6) ; also sheet 3
PMOD1_9: PMOD1.9(IO7) ; also sheet 3
PMOD1_10: PMOD1.10(IO8) ; also sheet 3
PMOD2_1: PMOD2.1(IO1) ; also sheet 3
PMOD2_2: PMOD2.2(IO2) ; also sheet 3
PMOD2_3: PMOD2.3(IO3) ; also sheet 3
PMOD2_4: PMOD2.4(IO4) ; also sheet 3
PMOD2_7: PMOD2.7(IO5) ; also sheet 3
PMOD2_8: PMOD2.8(IO6) ; also sheet 3
PMOD2_9: PMOD2.9(IO7) ; also sheet 3
PMOD2_10: PMOD2.10(IO8) ; also sheet 3

## Library data of the parts
BBB = beaglebone_cape:BEAGLEBONE_CAPE_CONNECTORS
C1-C13 C15 C16 C19 C21-C24 C26-C39 = rcl:C-EU: CAPACITOR, European symbol
D1 D2 = diode:DIODE-: DIODE
D4 DC1 = led:LED: LED OSRAM: - CHIPLED LG R971, LG N971, LY N971, LG Q971, LY Q971, LO R971, LY R971 LH N974, LH R974 LS Q976, LO Q976, LY Q976 LO Q996 - Hyper CHIPLED LW Q18S LB Q993, LB Q99A, LB R99A - SideLED LS A670, LO A670, LY A670, LG A670, LP A670 LB A673, LV A673, LT A673, LW A673 LH A674 LY A675 LS A676, LA A676, LO A676, LY A676, LW A676 LS A679, LY A679, LG A679 - Hyper Micro SIDELED® LS Y876, LA Y876, LO Y876, LY Y876 LT Y87S - SmartLED LW L88C, LW L88S LB L89C, LB L89S, LG L890 LS L89K, LO L89K, LY L89K LS L896, LA L896, LO L896, LY L896 - TOPLED LS T670, LO T670, LY T670, LG T670, LP T670 LSG T670, LSP T670, LSY T670, LOP T670, LYG T670 LG T671, LOG T671, LSG T671 LB T673, LV T673, LT T673, LW T673 LH T674 LS T676, LA T676, LO T676, LY T676, LB T676, LH T676, LSB T676, LW T676 LB T67C, LV T67C, LT T67C, LS T67K, LO T67K, LY T67K, LW E67C LS E67B, LA E67B, LO E67B, LY E67B, LB E67C, LV E67C, LT E67C LW T67C LS T679, LY T679, LG T679 LS T770, LO T770, LY T770, LG T770, LP T770 LB T773, LV T773, LT T773, LW T773 LH T774 LS E675, LA E675, LY E675, LS T675 LS T776, LA T776, LO T776, LY T776, LB T776 LHGB T686 LT T68C, LB T68C - Hyper Mini TOPLED® LB M676 - Mini TOPLED Santana® LG M470 LS M47K, LO M47K, LY M47K Source: http://www.osram.convergy.de LUXEON: - LUMILED® LXK2-PW12-R00, LXK2-PW12-S00, LXK2-PW14-U00, LXK2-PW14-V00 LXK2-PM12-R00, LXK2-PM12-S00, LXK2-PM14-U00 LXK2-PE12-Q00, LXK2-PE12-R00, LXK2-PE12-S00, LXK2-PE14-T00, LXK2-PE14-U00 LXK2-PB12-K00, LXK2-PB12-L00, LXK2-PB12-M00, LXK2-PB14-N00, LXK2-PB14-P00, LXK2-PB14-Q00 LXK2-PR12-L00, LXK2-PR12-M00, LXK2-PR14-Q00, LXK2-PR14-R00 LXK2-PD12-Q00, LXK2-PD12-R00, LXK2-PD12-S00 LXK2-PH12-R00, LXK2-PH12-S00 LXK2-PL12-P00, LXK2-PL12-Q00, LXK2-PL12-R00 Source: www.luxeon.com KINGBRIGHT: KA-3528ASYC Source: www.kingbright.com
J1 = pinhead:PINHD-1X2: PIN HEADER
J3 JP1 = pinhead:PINHD-1X6: PIN HEADER
JP2-JP7 = sparkfun:SOLDERJUMPER: Solder Jumper Standard SMD solder jumper. Used to automate production. Two varients : Normally Open and Normally Closed are the same, but have different paste layers. NC will have a large amount of paste and should jumper during reflow.
P3 = pinhead:PINHD-1X3: PIN HEADER
PMOD1 PMOD2 = pmod:PMOD_2
R1-R7 R9 R10 R12-R15 R18-R20 R26 R27 R29 R30 R100 R101 = rcl:R-EU_: RESISTOR, European symbol
SJ1-SJ3 = jumper:SJ: SMD solder JUMPER
U1 U2 = twam-vreg:TLV1117V
U3 = micro-philips:PCA9534: 8-bit I2C-bus and SMBus low power I/O port with interrupt Source: www.nxp.com .. PCA9534_3.pdf; MPN: PCA9534PW; OC_FARNELL: 1408285; OC_NEWARK: 18M7516
U4 = fpga:XC6SLX9
U5 = oscillator:ASDMB
U7 = microchip:24*: Serial EEPROM I2C; MF: MICROCHIP; MPN: 24LC256-I/SN; OC_FARNELL: 9757996; OC_NEWARK: 27C9144
U8 = flash:M25PE16

## Board
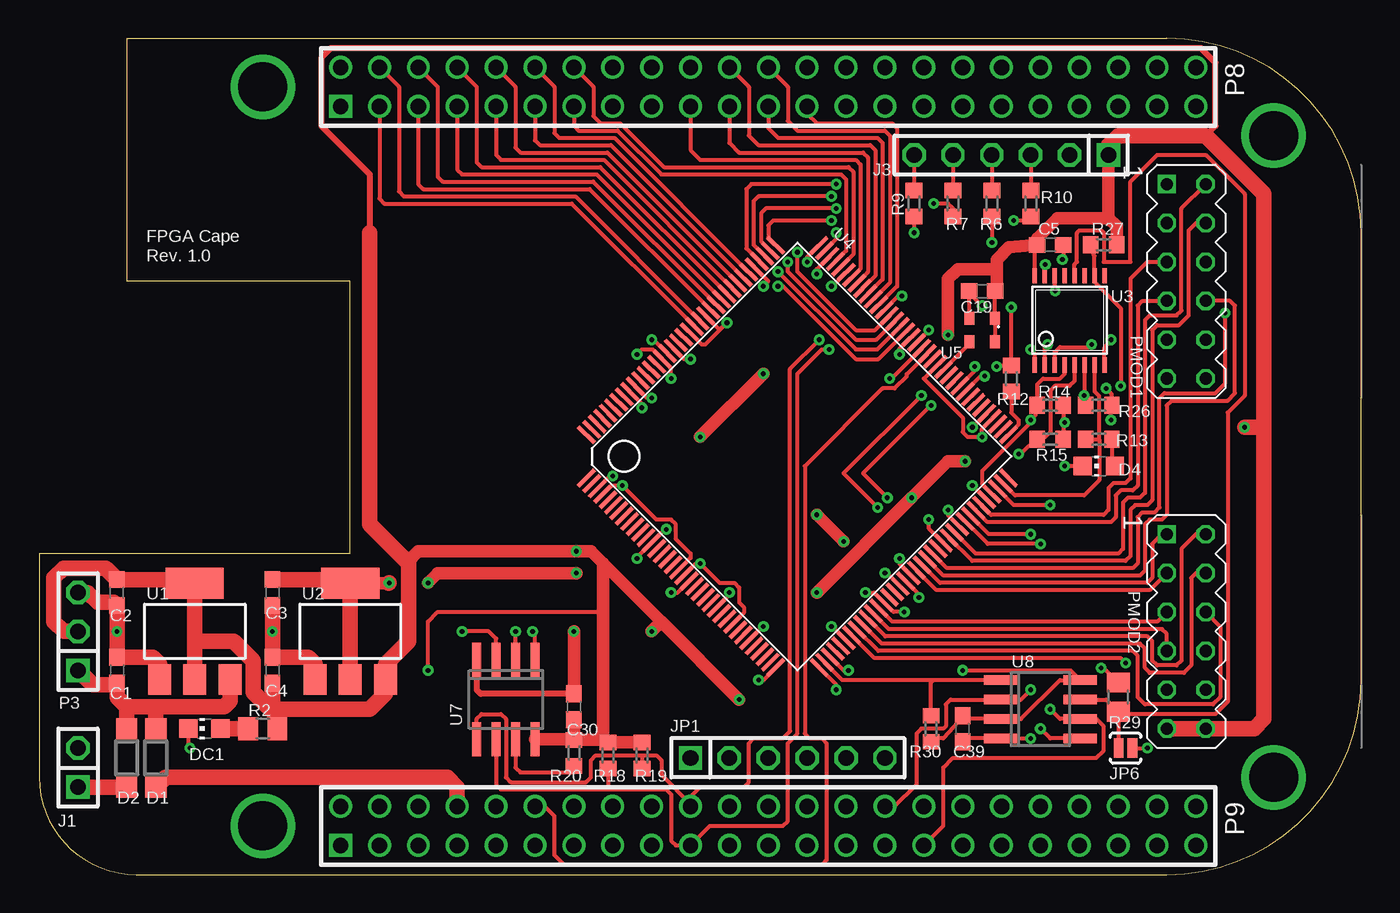
[diagram p5: board, top side]
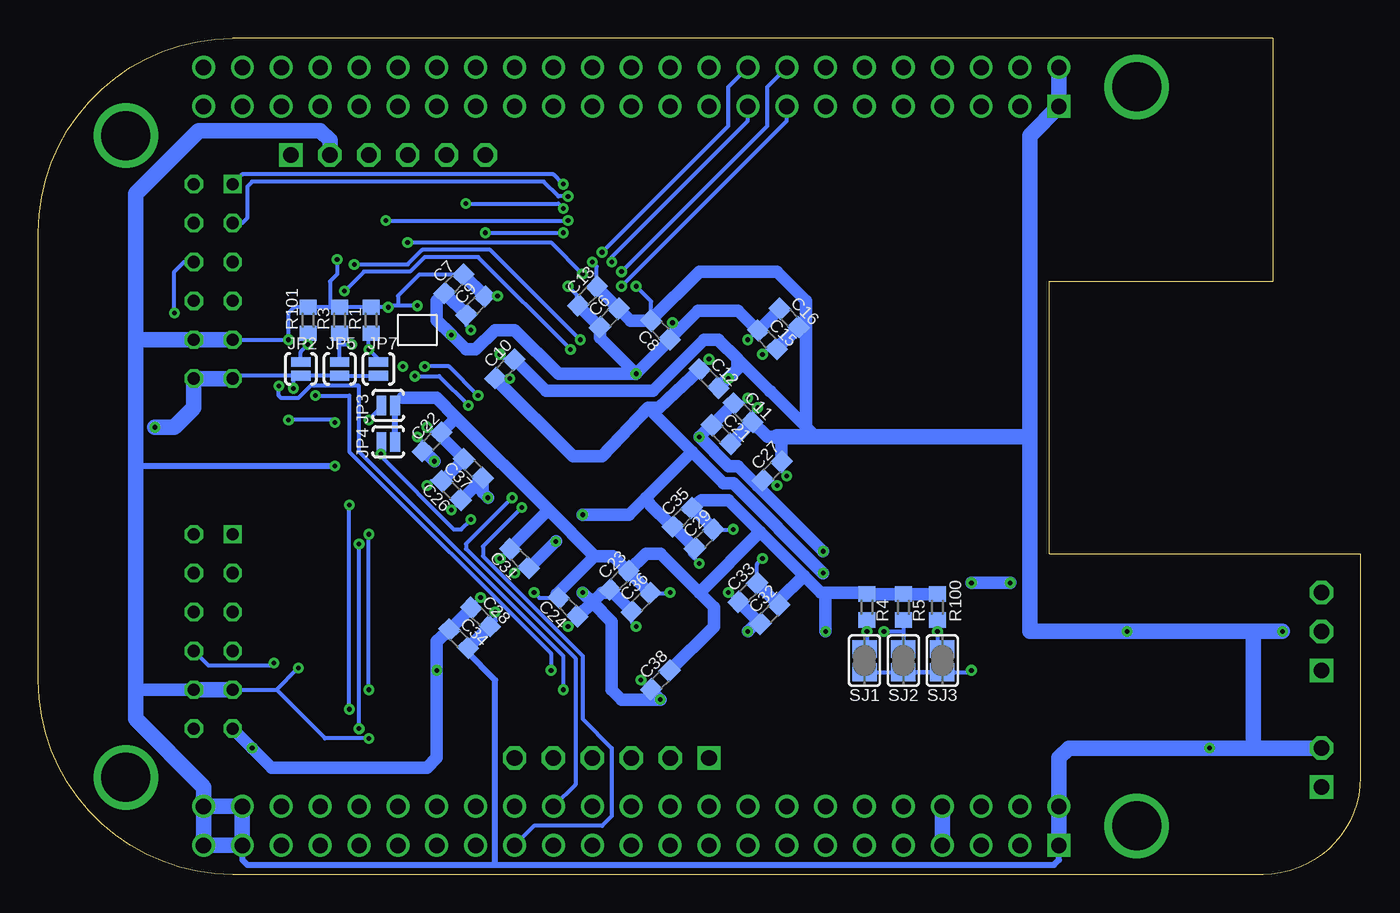
[diagram p6: board, bottom side, seen from below]

Size 86.36 x 54.61 mm. Coordinates in mm from the lower left corner, seen from the top.
Copper layers (1*16): Top 0.035mm / dielectric 1.5mm / Bottom 0.035mm
Design rules "platinensammler_02": minimum track width 0.15mm, minimum drill 0.3mm, track to track 0.15mm, track to pad 0.15mm, pad to pad 0.15mm, via to via 0.15mm, smd to smd 0mil, copper to edge 0.2mm, drill to drill 0.2mm, minimum pad ring 0.2mm, minimum via ring 0.2mm, stop-mask expansion 4mil, vias tented up to drill 0.8mm, thermal gap 0.15mm

### Footprints (pad centres in the part's own frame; a part is rotated, then mirrored left to right if it is on the bottom)
BEAGLEBONE_CAPE = drill 3.2: HOLE1 14.605,3.175; HOLE2 80.645,6.35; HOLE3 14.605,51.435; HOLE4 80.645,48.26 | drill 1 square: P8.1 19.685,50.165; P9.1 19.685,1.905 | drill 1: P8.2 19.685,52.705; P8.3 22.225,50.165; P8.4 22.225,52.705; P8.5 24.765,50.165; P8.6 24.765,52.705; P8.7 27.305,50.165; P8.8 27.305,52.705; P8.9 29.845,50.165; P8.10 29.845,52.705; P8.11 32.385,50.165; P8.12 32.385,52.705; P8.13 34.925,50.165; P8.14 34.925,52.705; P8.15 37.465,50.165; P8.16 37.465,52.705; P8.17 40.005,50.165; P8.18 40.005,52.705; P8.19 42.545,50.165; P8.20 42.545,52.705; P8.21 45.085,50.165; P8.22 45.085,52.705; P8.23 47.625,50.165; P8.24 47.625,52.705; P8.25 50.165,50.165; P8.26 50.165,52.705; P8.27 52.705,50.165; P8.28 52.705,52.705; P8.29 55.245,50.165; P8.30 55.245,52.705; P8.31 57.785,50.165; P8.32 57.785,52.705; P8.33 60.325,50.165; P8.34 60.325,52.705; P8.35 62.865,50.165; P8.36 62.865,52.705; P8.37 65.405,50.165; P8.38 65.405,52.705; P8.39 67.945,50.165; P8.40 67.945,52.705; P8.41 70.485,50.165; P8.42 70.485,52.705; P8.43 73.025,50.165; P8.44 73.025,52.705; P8.45 75.565,50.165; P8.46 75.565,52.705; P9.2 19.685,4.445; P9.3 22.225,1.905; P9.4 22.225,4.445; P9.5 24.765,1.905; P9.6 24.765,4.445; P9.7 27.305,1.905; P9.8 27.305,4.445; P9.9 29.845,1.905; P9.10 29.845,4.445; P9.11 32.385,1.905; P9.12 32.385,4.445; P9.13 34.925,1.905; P9.14 34.925,4.445; P9.15 37.465,1.905; P9.16 37.465,4.445; P9.17 40.005,1.905; P9.18 40.005,4.445; P9.19 42.545,1.905; P9.20 42.545,4.445; P9.21 45.085,1.905; P9.22 45.085,4.445; P9.23 47.625,1.905; P9.24 47.625,4.445; P9.25 50.165,1.905; P9.26 50.165,4.445; P9.27 52.705,1.905; P9.28 52.705,4.445; P9.29 55.245,1.905; P9.30 55.245,4.445; P9.31 57.785,1.905; P9.32 57.785,4.445; P9.33 60.325,1.905; P9.34 60.325,4.445; P9.35 62.865,1.905; P9.36 62.865,4.445; P9.37 65.405,1.905; P9.38 65.405,4.445; P9.39 67.945,1.905; P9.40 67.945,4.445; P9.41 70.485,1.905; P9.42 70.485,4.445; P9.43 73.025,1.905; P9.44 73.025,4.445; P9.45 75.565,1.905; P9.46 75.565,4.445
C0603 = smd 1.1 x 1: 1 -0.85,0; 2 0.85,0
SOD123 = smd 1.4 x 1.4: A 1.9,0; C -1.9,0
CHIP-LED0805 = smd 1.2 x 1.2: A 0,-1.05; C 0,1.05
1X02 = drill 1.016 square: 1 -1.27,0 | drill 1.016 octagon: 2 1.27,0
1X06 = drill 1.016 square: 1 -6.35,0 | drill 1.016 octagon: 2 -3.81,0; 3 -1.27,0; 4 1.27,0; 5 3.81,0; 6 6.35,0
SJ_2S-NO = smd 0.635 x 1.27: 1 -0.45,0; 2 0.45,0
1X03 = drill 1.016 square: 1 -2.54,0 | drill 1.016 octagon: 2 0,0; 3 2.54,0
PMOD_2_HOST = drill 0.8 square: 1 -6.35,-1.27 | drill 0.8 octagon: 2 -3.81,-1.27; 3 -1.27,-1.27; 4 1.27,-1.27; 5 3.81,-1.27; 6 6.35,-1.27; 7 -6.35,1.27; 8 -3.81,1.27; 9 -1.27,1.27; 10 1.27,1.27; 11 3.81,1.27; 12 6.35,1.27
R0603 = smd 1 x 1.1: 1 -0.85,0; 2 0.85,0
R0805 = smd 1.3 x 1.5: 1 -0.95,0; 2 0.95,0
SJ = smd 1.168 x 1.6: 1 -0.762,0; 2 0.762,0
SOT223 = smd 1.5 x 2: 1 -2.3,-3.15; 2 0,-3.15; 3 2.3,-3.15 | smd 3.8 x 2: 4 0,3.15
TSSOP16 = smd 0.305 x 0.991: 1 -2.275,-2.918; 2 -1.625,-2.918; 3 -0.975,-2.918; 4 -0.325,-2.918; 5 0.325,-2.918; 6 0.975,-2.918; 7 1.625,-2.918; 8 2.275,-2.918; 9 2.275,2.918; 10 1.625,2.918; 11 0.975,2.918; 12 0.325,2.918; 13 -0.325,2.918; 14 -0.975,2.918; 15 -1.625,2.918; 16 -2.275,2.918
TQFP144 = smd 0.27 x 1.5: 1 -8.75,-10.75; 2 -8.25,-10.75; 3 -7.75,-10.75; 4 -7.25,-10.75; 5 -6.75,-10.75; 6 -6.25,-10.75; 7 -5.75,-10.75; 8 -5.25,-10.75; 9 -4.75,-10.75; 10 -4.25,-10.75; 11 -3.75,-10.75; 12 -3.25,-10.75; 13 -2.75,-10.75; 14 -2.25,-10.75; 15 -1.75,-10.75; 16 -1.25,-10.75; 17 -0.75,-10.75; 18 -0.25,-10.75; 19 0.25,-10.75; 20 0.75,-10.75; 21 1.25,-10.75; 22 1.75,-10.75; 23 2.25,-10.75; 24 2.75,-10.75; 25 3.25,-10.75; 26 3.75,-10.75; 27 4.25,-10.75; 28 4.75,-10.75; 29 5.25,-10.75; 30 5.75,-10.75; 31 6.25,-10.75; 32 6.75,-10.75; 33 7.25,-10.75; 34 7.75,-10.75; 35 8.25,-10.75; 36 8.75,-10.75; 73 8.75,10.75; 74 8.25,10.75; 75 7.75,10.75; 76 7.25,10.75; 77 6.75,10.75; 78 6.25,10.75; 79 5.75,10.75; 80 5.25,10.75; 81 4.75,10.75; 82 4.25,10.75; 83 3.75,10.75; 84 3.25,10.75; 85 2.75,10.75; 86 2.25,10.75; 87 1.75,10.75; 88 1.25,10.75; 89 0.75,10.75; 90 0.25,10.75; 91 -0.25,10.75; 92 -0.75,10.75; 93 -1.25,10.75; 94 -1.75,10.75; 95 -2.25,10.75; 96 -2.75,10.75; 97 -3.25,10.75; 98 -3.75,10.75; 99 -4.25,10.75; 100 -4.75,10.75; 101 -5.25,10.75; 102 -5.75,10.75; 103 -6.25,10.75; 104 -6.75,10.75; 105 -7.25,10.75; 106 -7.75,10.75; 107 -8.25,10.75; 108 -8.75,10.75 | smd 1.5 x 0.27: 37 10.75,-8.75; 38 10.75,-8.25; 39 10.75,-7.75; 40 10.75,-7.25; 41 10.75,-6.75; 42 10.75,-6.25; 43 10.75,-5.75; 44 10.75,-5.25; 45 10.75,-4.75; 46 10.75,-4.25; 47 10.75,-3.75; 48 10.75,-3.25; 49 10.75,-2.75; 50 10.75,-2.25; 51 10.75,-1.75; 52 10.75,-1.25; 53 10.75,-0.75; 54 10.75,-0.25; 55 10.75,0.25; 56 10.75,0.75; 57 10.75,1.25; 58 10.75,1.75; 59 10.75,2.25; 60 10.75,2.75; 61 10.75,3.25; 62 10.75,3.75; 63 10.75,4.25; 64 10.75,4.75; 65 10.75,5.25; 66 10.75,5.75; 67 10.75,6.25; 68 10.75,6.75; 69 10.75,7.25; 70 10.75,7.75; 71 10.75,8.25; 72 10.75,8.75; 109 -10.75,8.75; 110 -10.75,8.25; 111 -10.75,7.75; 112 -10.75,7.25; 113 -10.75,6.75; 114 -10.75,6.25; 115 -10.75,5.75; 116 -10.75,5.25; 117 -10.75,4.75; 118 -10.75,4.25; 119 -10.75,3.75; 120 -10.75,3.25; 121 -10.75,2.75; 122 -10.75,2.25; 123 -10.75,1.75; 124 -10.75,1.25; 125 -10.75,0.75; 126 -10.75,0.25; 127 -10.75,-0.25; 128 -10.75,-0.75; 129 -10.75,-1.25; 130 -10.75,-1.75; 131 -10.75,-2.25; 132 -10.75,-2.75; 133 -10.75,-3.25; 134 -10.75,-3.75; 135 -10.75,-4.25; 136 -10.75,-4.75; 137 -10.75,-5.25; 138 -10.75,-5.75; 139 -10.75,-6.25; 140 -10.75,-6.75; 141 -10.75,-7.25; 142 -10.75,-7.75; 143 -10.75,-8.25; 144 -10.75,-8.75
ASDMB = smd 0.65 x 0.85: 1 -0.825,-0.775; 2 0.825,-0.775; 3 0.825,0.775; 4 -0.825,0.775
SO-08 = smd 0.6 x 2.2: 1 -1.905,-2.6; 2 -0.635,-2.6; 3 0.635,-2.6; 4 1.905,-2.6; 5 1.905,2.6; 6 0.635,2.6; 7 -0.635,2.6; 8 -1.905,2.6
SO8 = smd 0.6 x 2.2: 1 -1.905,-2.6; 2 -0.635,-2.6; 3 0.635,-2.6; 4 1.905,-2.6; 5 1.905,2.6; 6 0.635,2.6; 7 -0.635,2.6; 8 -1.905,2.6

### Placement (x,y rotation side)
BBB  0,0 0 top
C1  5.08,13.34 270 top
C2  5.08,18.41 90 top
C3  15.24,18.41 90 top
C4  15.24,13.34 270 top
C5  66.04,41.12 0 top
C6  49.05,36.35 45 bottom
C7  59.21,38.58 45 bottom
C8  45.72,35.56 135 bottom
C9  57.78,37.15 45 bottom
C10  55.88,33.02 45 bottom
C11  40.32,30.16 315 bottom
C12  42.55,32.38 315 bottom
C13  50.48,37.78 45 bottom
C15  38.73,34.92 315 bottom
C16  37.31,36.35 315 bottom
C19  61.59,38.1 180 top
C21  41.75,28.73 315 bottom
C22  60.64,28.26 45 bottom
C23  48.42,19.21 45 bottom
C24  51.75,17.46 135 bottom
C26  59.37,25.08 135 bottom
C27  38.42,26.35 45 bottom
C28  57.47,16.83 315 bottom
C29  42.86,21.91 45 bottom
C30  34.92,10.95 270 top
C31  54.93,20.64 135 bottom
C32  38.58,16.99 45 bottom
C33  40.01,18.41 45 bottom
C34  58.9,15.4 315 bottom
C35  44.29,23.34 45 bottom
C36  46.99,17.78 45 bottom
C37  57.94,26.51 135 bottom
C38  45.72,12.7 45 bottom
C39  60.33,9.53 90 top
D1  7.62,7.62 270 top
D2  5.71,7.62 270 top
D4  69.22,26.67 90 top
DC1  10.79,9.53 90 top
J1  2.54,6.99 90 top
J3  63.5,46.99 180 top
JP1  48.9,7.62 0 top
JP2  69.22,33.02 270 bottom
JP3  63.5,30.64 180 bottom
JP4  63.5,28.26 180 bottom
JP5  66.67,33.02 270 bottom
JP6  70.96,8.26 0 top
JP7  64.14,33.02 270 bottom
P3  2.54,15.88 90 top
PMOD1  74.93,38.73 270 top
PMOD2  74.93,15.88 270 top
R1  64.61,36.2 90 bottom
R2  14.61,9.53 0 top
R3  66.67,36.2 90 bottom
R4  32.23,17.46 270 bottom
R5  29.84,17.46 270 bottom
R6  62.23,43.81 270 top
R7  59.69,43.81 270 top
R9  57.15,43.81 270 top
R10  64.77,43.81 270 top
R12  63.5,32.38 270 top
R13  69.22,28.42 180 top
R14  66.04,30.64 0 top
R15  66.04,28.42 0 top
R18  37.15,7.78 90 top
R19  39.37,7.78 90 top
R20  34.92,7.94 90 top
R26  69.22,30.64 180 top
R27  69.53,41.12 0 top
R29  70.48,11.59 270 top
R30  58.26,9.53 270 top
R100  27.62,17.46 270 bottom
R101  68.74,36.2 90 bottom
SJ1  32.38,13.97 90 bottom
SJ2  29.84,13.97 90 bottom
SJ3  27.3,13.97 90 bottom
U1  10.16,15.88 0 top
U2  20.32,15.88 0 top
U3  67.31,36.2 0 top
U4  49.53,27.3 315 top
U5  61.59,35.56 180 top
U7  30.48,11.43 180 top
U8  65.41,10.79 270 top

### Tracks (layer width: path | path; a pad name or v marks a point on that pad's centre or on a via)
+1V2  (via drill 0.3)
  Top 0.254: v42.55,33.66 42.12,33.66 U4.128 | U4.19 42.86,20.28 v43.18,20.32 44.45,19.05 45.4,19.05 45.72,18.73 45.72,17.78 46.04,17.46 46.04,17.09 U4.28 | v55.24,19.68 55.38,19.68 U4.52 | v55.56,32.38 55.67,32.38 U4.89
  Top 0.305: 34.29,19.68 34.29,19.64
  Top 0.406: 20.08,19.27 U2.4
  Top 0.813: U2.4 22.84,19.02 | v25.4,19.05 26.04,19.68 34.29,19.68 v35.08,19.68 | v52.55,21.75 v50.8,23.5
  Top 1.016: U2.2 U2.4 | C3.2 20.08,19.27 | 22.84,19.02 v22.86,19.05
  Bottom 0.254: C12.1 43.15,33.05 v42.55,33.66 | C29.1 43.46,21.24 43.81,21.24 43.81,20.95 v43.18,20.32 | C31.1 54.89,20.04 v55.24,19.68 | C35.1 45.12,22.89 | 56.48,32.35 C10.1 56.39,32.42 v55.56,32.38
  Bottom 0.813: 43.21,32.99 C12.1 45.81,30.48 46.51,30.48 | v22.86,19.05 v25.4,19.05 | v35.08,19.68 40.96,25.56 41.59,25.56 43.66,27.62 | 43.66,27.62 46.51,30.48 | 45.12,22.89 46.35,24.13 46.67,24.61 | 46.67,24.61 43.66,27.62 | 56.48,32.35 51.44,27.3 49.53,27.3 46.51,30.48 | 54.26,20.04 v52.55,21.75 | v50.8,23.5 47.78,23.5 46.67,24.61 | C35.1 C29.1
  Bottom 1.016: C31.1 54.26,20.04
+3V3  (via drill 0.3)
  Top 0.254: v40.01,34.92 40.14,34.92 U4.129 | v40.01,31.11 39.71,31.11 U4.135 | U4.4 37.37,25.4 v38.1,25.4 40.32,23.18 41.27,23.18 41.59,22.86 41.59,21.91 42.55,20.95 42.55,20.67 U4.18 41.79,19.88 | v47.31,16.19 47.26,16.19 U4.31 | v46.99,12.7 47.3,12.7 U4.36 | v41.27,18.41 41.7,18.41 U4.20 | v57.47,18.1 57.47,18.31 U4.53 | v51.75,16.19 51.8,16.19 U4.42 | v59.37,23.81 59.37,23.47 U4.63 | v51.75,38.42 51.8,38.42 U4.103 | U4.76 61.59,29.12 v61.59,28.57 60.64,28.57 60.33,28.89 60.33,29.84 57.78,32.38 U4.86 | v58.1,35.56 58.1,35.52 U4.90 | U4.122 44.45,35.57 v44.93,36.04 43.5,34.61 43.29,34.61 U4.125 | R30.2 58.48,8.89 59.05,8.89 60.33,10.32 C39.2 60.54,10.16 U8.3 64.14,10.16 66.67,12.7 U8.8 67.37,13.34 v60.33,13.34 | U5.4 U5.1 62.42,38.08 C19.1 62.55,38.2 | 34.72,8.83 R20.2 | R15.2 R14.2 66.89,29.79 v66.99,29.53 | U3.16 65.03,40.64 C5.1 | v69.69,31.75 70.06,31.38 R26.1 70.01,30.58 v70.01,29.69 | v25.4,13.34 25.4,16.51 26.04,17.14 36.83,17.14 | JP6.2 v72.39,8.26
  Top 0.406: 9.92,19.27 U1.4 | U2.3 22.62,11.82 | 76.2,48.26 76.83,48.9 76.83,53.02 75.88,53.98 19.05,53.98 18.41,53.34 18.41,48.9 21.59,45.72 21.59,22.86
  Top 0.813: C30.2 R20.2 36.99,8.79 R18.2 | U7.8 34.72,8.83 | 62.55,39.53 62.55,40.16 63.34,40.96 C5.1 65.19,41.54 66.52,42.86 69.85,42.86 | 62.55,39.53 62.55,38.2 | R27.2 70.38,42.33 69.85,42.86 | J3.1 69.85,42.86 | 24.05,20.4 24.77,21.11 v35.08,21.11 36.04,21.11 36.83,20.32 | 36.83,20.32 36.83,17.14 36.83,8.95 R18.2 | v43.18,28.57 v47.31,32.7 | v50.8,18.41 v56.99,24.61 59.37,26.99 v60.48,26.99 | 62.55,39.53 60.01,39.53 59.37,38.89 v59.37,35.24 | v40.01,15.88 40.64,16.51 | 40.64,16.51 36.83,20.32 | v45.72,11.43 40.64,16.51 | R18.2 R19.2
  Top 1.016: 9.92,19.27 C2.2 4.34,20 1.59,20 0.95,19.37 0.95,16.51 1.59,15.88 P3.2 | U1.4 10.16,15.24 | 22.62,11.82 21.59,10.79 15.88,10.79 15.55,10.47 R2.2 | U1.2 10.16,15.24 | 10.16,15.24 12.7,15.24 13.97,13.97 13.97,11.91 14.92,10.95 | C4.2 15.24,11.27 14.92,10.95 | R2.2 | 14.92,10.95 15.56,10.32 R2.2 | 21.59,41.91 21.59,22.86 24.05,20.4 24.13,20.32 24.13,15.24 22.62,13.73 U2.3 | PMOD2.6 PMOD2.12 79.38,9.53 80.01,10.16 80.01,29.21 | v78.74,29.21 80.01,29.21 | 80.01,29.21 80.01,44.45 76.2,48.26 70.48,48.26 69.85,47.62 J3.1
  Bottom 0.254: v40.01,34.92 39.4,35.53 C15.1 39.37,35.56 | C11.1 40.36,30.76 v40.01,31.11 | v44.93,36.04 45.05,34.96 C8.1 45.12,34.89 | v38.1,25.4 38.45,25.75 C27.1 38.73,26.04 | C36.1 47.59,16.48 v47.31,16.19 | C38.1 46.39,12.1 v46.99,12.7 | C33.1 40.67,17.81 v41.27,18.41 | C28.1 58.07,17.5 v57.47,18.1 | C24.1 51.15,16.79 v51.75,16.19 | C26.1 58.77,24.41 v59.37,23.81 | C13.1 51.15,37.82 v51.75,38.42 | v61.59,28.57 61.24,28.22 C22.1 61.15,27.66 | C9.1 58.39,35.84 v58.1,35.56 | JP7.2 JP5.2 JP2.2 69.69,32.57 | C23.1 49.41,18.61 | C32.1 39.49,16.39 | C7.1 59.81,38.23 | 69.69,32.57 73.47,32.57 PMOD1.6 | v69.69,31.75 69.69,32.57 | SJ3.1 SJ2.1 SJ1.1 25.53,13.21 v25.4,13.34 | v66.99,29.53 67.15,29.69 v70.01,29.69 | 39.37,35.56
  Bottom 0.813: C28.1 C34.1 60.33,15.24 v60.33,13.34 60.33,7.62 60.96,6.99 71.12,6.99 v72.39,8.26 PMOD2.6 | 39.37,25.4 40.64,26.67 41.27,26.67 v43.18,28.57 42.42,29.34 C21.1 C11.1 | 39.37,25.4 v35.08,21.11 | C13.1 C6.1 49.66,35.05 v47.31,32.7 | C16.1 C15.1 | 39.37,35.56 40.64,36.83 43.25,36.83 C8.1 | C36.1 C23.1 49.21,18.41 49.53,18.41 50.16,17.78 | C24.1 51.08,16.86 50.16,17.78 | 50.16,17.78 48.9,16.51 48.9,12.06 48.26,11.43 v45.72,11.43 46.32,12.03 C38.1 | 50.16,17.78 v50.8,18.41 | 61.15,27.66 v60.48,26.99 | v56.99,24.61 57.34,24.96 C37.1 57.78,25.47 57.78,25.4 58.7,24.48 C26.1 | C9.1 C7.1 60.33,37.47 60.33,36.2 v59.37,35.24 58.42,34.29 57.78,34.29 56.52,35.56 55.24,35.56 52.39,32.7 v47.31,32.7 | v47.31,32.7 45.05,34.96 | C33.1 C32.1 | 39.49,16.39 v40.01,15.88 | C27.1 39.37,25.4
  Bottom 1.016: PMOD1.6 PMOD1.12 76.2,30.48 77.47,29.21 v78.74,29.21
+5V_BB
  Top 1.016: D1.A 8.26,6.35 26.66,6.36 27.3,5.71 BBB.P9.8
  Bottom 1.016: BBB.P9.8 BBB.P9.7
ADDR0  (via drill 0.3)
  Top 0.254: U7.1 32.38,15.72 v32.23,15.88
  Bottom 0.254: 32.38,15.24 SJ1.2 32.23,14.89 v32.23,15.88 R4.2
ADDR1  (via drill 0.3)
  Top 0.254: U7.2 v31.11,15.88
  Bottom 0.254: R5.2 29.84,15.88 | 29.84,15.88 SJ2.2 | v31.11,15.88 29.84,15.88
ADDR2  (via drill 0.3)
  Top 0.254: U7.3 29.84,15.4 29.37,15.88 v27.62,15.88
  Bottom 0.254: SJ3.2 27.62,15.05 v27.62,15.88 R100.2
BB_CFG_SCL  (via drill 0.3)
  Top 0.254: U7.6 29.84,5.87 30.16,5.56 37.15,5.56 | R18.1 37.15,5.56 | 37.15,5.56 40.96,5.56 41.27,5.24 41.27,2.22 41.59,1.91 BBB.P9.19 43.81,3.17 48.58,3.17 48.9,3.49 48.9,8.57 49.53,9.21 49.53,32.7 51.12,34.29 v51.59,34.29 | v66.36,38.1 66.36,39.09 U3.14
  Bottom 0.254: v51.59,34.29 57.63,40.32 61.12,40.32 62.07,39.37 65.09,39.37 v66.36,38.1
BB_CFG_SDA  (via drill 0.3)
  Top 0.254: U7.5 28.57,10.16 28.89,10.48 30.16,10.48 30.48,10.16 30.48,6.35 30.8,6.03 35.72,6.03 36.04,6.35 36.04,7.46 36.35,7.78 39.37,7.78 | 39.37,7.78 R19.1 | 39.37,7.78 40.32,7.78 40.64,7.46 40.64,6.51 42.55,4.6 BBB.P9.20 42.55,5.08 43.18,5.71 46.04,5.71 46.35,6.03 46.35,8.57 46.67,8.89 48.58,8.89 49.05,9.37 49.05,33.02 v50.96,34.92 | U3.15 65.69,39.81 v65.72,39.85
  Bottom 0.254: v50.96,34.92 56.83,40.8 61.28,40.8 62.23,39.85 v65.72,39.85
BB_SPI_MISO  (via drill 0.3)
  Top 0.254: v61.12,33.18 61.12,32.88 U4.82 | v54.77,23.97 52.55,26.19 v57.63,31.27
  Bottom 0.254: v54.77,23.97 57.31,21.43 57.31,20.8 50.8,14.29 50.8,10.16 48.9,8.26 48.9,3.81 49.53,3.17 53.98,3.17 BBB.P9.29 | v57.63,31.27 59.53,33.18 v61.12,33.18
BB_SPI_SS  (via drill 0.3)
  Top 0.254: v61.75,32.54 61.49,32.54 U4.81 | v55.4,24.61 53.82,26.19 v58.26,30.64
  Bottom 0.254: v55.4,24.61 58.42,21.59 58.42,21.27 51.28,14.13 51.28,5.87 BBB.P9.28 | v61.75,32.54 60.17,32.54 v58.26,30.64
EE_EP
  Top 0.254: U7.7 31.11,6.99 31.43,6.67 34.82,6.67 R20.1
FLASH_CLK/BB_SPI_SCK  (via drill 0.3)
  Top 0.254: BBB.P9.31 59.05,3.17 59.05,6.99 59.69,7.62 69.06,7.62 69.53,8.1 69.53,9.68 69.06,10.16 U8.6 66.67,10.16 v66.04,10.79 | v66.04,24.13 63.66,24.13 U4.70
  Bottom 0.254: v66.04,10.79 v66.04,24.13
FLASH_CS
  Top 0.254: U8.1 58.42,12.7 | 58.42,12.7 52.47,12.7 U4.38 | R30.1 58.26,12.54 58.42,12.7
FLASH_MISO/BB_SPI_MOSI  (via drill 0.3)
  Top 0.254: BBB.P9.30 55.88,4.45 57.31,5.87 57.31,9.21 57.63,9.53 59.05,9.53 59.21,9.68 59.21,11.11 59.53,11.43 U8.2 64.14,11.43 v64.77,12.06 | v64.77,22.23 62.03,22.23 U4.65
  Bottom 0.254: v64.77,12.06 v64.77,22.23
FLASH_MOSI  (via drill 0.3)
  Top 0.254: U8.5 66.04,8.89 v65.41,9.53 | v65.41,21.59 61.96,21.59 U4.64
  Bottom 0.254: v65.41,9.53 v65.41,21.59
FLASH_RESET
  Top 0.254: U8.7 69.69,11.43 R29.2 | R29.2 70.48,8.28 JP6.1 | U3.12 67.64,39.85 67.79,40.01 67.79,41.91 67.94,42.07 69.37,42.07 69.53,41.91 69.53,40.01 71.28,40.01 71.28,45.24 73.03,46.99 76.2,46.99 78.74,44.45 78.74,31.27 77.63,30.16 77.63,11.27 76.83,10.48 70.65,10.48 R29.2
FPGA_DONE
  Top 0.254: U3.7 68.94,31.55 69.25,31.24 69.25,28.42 | 69.25,28.42 69.25,25.75 68.26,24.77 63.74,24.77 U4.71 | R13.2 69.25,28.42
FPGA_INIT_B  (via drill 0.3)
  Top 0.254: v52.86,13.34 52.54,13.34 U4.39 | U3.6 68.28,30.88 R26.2 68.26,30.54 v68.26,31.27
  Bottom 0.254: v68.26,31.27 66.04,31.27 66.04,27.62 52.86,14.45 v52.86,13.34
FPGA_MODE0  (via drill 0.3)
  Top 0.254: U3.4 66.99,33.27 66.99,32.7 66.67,32.38 65.56,32.38 65.19,32.01 R14.1 65.09,30.64 65.09,30 v64.77,29.69 64.77,29.53 61.59,26.35 61.59,25.49 U4.69
  Bottom 0.254: JP3.2 63.95,30.51 v64.77,29.69
FPGA_MODE1  (via drill 0.3)
  Top 0.254: U3.5 67.63,33.27 67.63,32.23 67.31,31.91 66.36,31.91 66.04,31.59 66.04,28.89 65.72,28.57 R15.1 65.19,28.52 64.14,27.46 v63.98,27.46 | v58.1,23.18 58.1,22.62 U4.60
  Bottom 0.254: JP4.2 63.95,27.28 v63.98,27.46 63.98,27.3 59.21,22.54 58.74,22.54 v58.1,23.18
FPGA_PROGRAM  (via drill 0.3)
  Top 0.254: v52.07,12.06 52.07,12.39 U4.37 | R27.1 68.94,40.39 U3.10 68.94,38.7 70.64,36.99 v70.64,31.91
  Bottom 0.254: v52.07,12.06 52.07,14.29 65.41,27.62 65.41,31.91 68.58,31.91 69.37,31.11 70.48,31.11 70.64,31.27 v70.64,31.91
GND  (via drill 0.3)
  Top 0.254: v39.05,33.97 39.37,34.29 40.07,34.29 U4.130 41.27,33.09 v41.27,32.38 | v39.37,30.48 39.37,30.75 U4.136 | v47.31,38.42 47.62,38.76 U4.113 | v37.47,26.04 37.3,26.04 U4.3 | v40.96,22.54 40.88,22.54 U4.13 39.05,20.72 v39.05,20.64 | v45.09,18.41 45.09,18.26 U4.25 | v56.52,17.14 55.8,17.14 U4.49 54.53,18.41 v53.98,18.41 | v56.2,20.64 56.2,20.28 U4.54 | v60.96,25.4 60.98,25.4 U4.68 | v50.16,40.01 50.16,40.31 U4.108 | v60.96,29.21 60.98,29.21 U4.77 | v56.36,37.78 56.12,37.78 U4.96 | v56.2,33.97 56.2,34.33 U4.91 | C39.1 60.54,8.89 U8.4 v64.77,8.89 | U5.2 60.77,38.08 C19.2 60.74,38 v61.59,37.15 | U3.8 69.58,34.4 v70.01,34.92 | v63.5,37.05 R12.1 62.6,33.23 v62.55,33.18 | DC1.C 9.74,8.35 v9.84,8.26 | v69.37,13.49 69.53,13.49 R29.1 | D4.C v66.99,26.67 | C5.2 66.89,40.22 v66.83,40.16
  Top 0.406: C30.1 28.84,11.8 28.57,12.06 U7.4
  Top 0.813: C30.1 v34.92,15.88
  Top 1.016: U1.1 7.86,13.73 7.41,14.19 C1.1 v5.08,15.88 C2.1 4.87,17.78 3.81,17.78 3.17,18.41 P3.3 | C3.1 v15.24,15.88 C4.1 17.57,14.19 18.02,13.73 U2.1
  Bottom 0.254: C15.2 38.7,34.32 38.73,34.29 | C12.2 41.88,31.78 v41.27,32.38 | C11.2 39.72,30.13 v39.37,30.48 | C8.2 46.32,37.43 v47.31,38.42 | C27.2 37.82,26.39 v37.47,26.04 | C29.2 40.99,22.51 v40.96,22.54 | C36.2 45.12,18.38 v45.09,18.41 | C33.2 39.4,20.29 v39.05,20.64 | C28.2 56.48,16.54 v56.52,17.14 | v53.98,18.41 53.62,18.06 C24.2 | C31.2 55.6,21.24 v56.2,20.64 | C26.2 60.68,25.68 v60.96,25.4 | v50.16,40.01 49.88,39.72 C13.2 49.81,38.38 | v60.96,29.21 60.61,28.86 C22.2 60.04,28.61 | C9.2 56.8,37.75 v56.36,37.78 | v56.2,33.97 55.85,33.62 C10.2 55.24,33.66 55.24,33.5 | 67.31,37.05 R3.2 R1.2 v63.5,37.05 63.4,37.15 62.87,37.15 | 67.31,37.05 R101.2 69.64,37.05 70.01,36.67 v70.01,34.92 PMOD1.5 | v61.59,37.15 62.87,37.15 | PMOD2.5 70.8,12.06 | 70.8,12.06 v69.37,13.49 | v64.77,8.89 67.63,8.89 70.8,12.06 | 32.33,18.41 R4.1 | C7.2 61.47,39.18 62.87,37.78 62.87,37.15 | v39.05,33.97 38.73,34.29 | 38.73,34.29 38.1,34.29 | C6.2 48.38,36.95 | v66.83,40.16 66.83,39.21 67.31,38.73 67.31,37.05 | 62.55,31.14 JP3.1 | C31.2 | C31.2 55.24,20.95 | C34.2 58.3,14.73 58.42,14.61
  Bottom 0.406: BBB.P9.43 73.03,0.95 72.71,0.64 56.52,0.64 | 56.52,0.64 20,0.64 19.68,0.95 BBB.P9.1 | 56.52,0.64 56.52,12.7 58.42,14.61 | JP3.1 JP4.1 63.05,30.93 62.87,31.11 62.23,31.11 | v66.99,26.67 80.01,26.67 | C24.2 52.35,18.13 52.51,18.29
  Bottom 0.813: C28.2 C34.2 | R100.1 R5.1 R4.1 | 39.21,22.38 41.27,24.45 43.02,24.45 C35.2 43.62,23.94 42.55,22.86 | 39.21,22.38 36.35,19.53 | 36.35,19.53 35.24,18.41 34.92,18.41 | 34.92,18.41 32.33,18.41 | v34.92,15.88 34.92,18.41 | C7.2 C9.2 | 55.24,33.5 55.09,33.5 53.18,31.59 46.2,31.59 42.86,34.92 41.91,34.92 41.91,34.89 U4.130 | U4.130 U4.136 38.53,31.55 35.56,28.57 | C15.2 C16.2 | U4.130 40.69,33.04 C12.2 | 49.81,38.38 49.81,38.32 C6.2 47.66,36.16 C8.2 46.32,36.23 43.18,39.37 38.1,39.37 36.2,37.47 36.2,28.57 | C21.2 C11.2 38.73,28.57 38.1,28.57 37.82,28.29 C27.2 | C36.2 C23.2 | C23.2 46.67,20.95 45.72,20.95 43.18,18.41 | C38.2 42.23,16.19 42.23,17.46 43.18,18.41 | 43.18,18.41 39.21,22.38 | C33.2 C32.2 37.98,17.91 36.35,19.53 | 52.51,18.29 50.01,20.8 | 50.01,20.8 53.02,23.81 | 53.02,23.81 55.53,21.31 C31.2 | C26.2 C37.2 60.04,28.61 | 53.02,23.81 59.05,29.84 | 62.55,31.14 60.35,31.14 59.05,29.84 | 59.05,29.84 C22.2 | 50.01,20.8 48.8,20.8 C23.2 | PMOD2.11 80.01,12.06
  Bottom 1.016: BBB.P8.2 BBB.P8.1 21.59,48.26 21.59,28.57 | PMOD2.5 PMOD2.11 | PMOD1.5 PMOD1.11 80.01,34.92 | 6.99,8.26 v9.84,8.26 19.05,8.26 19.68,7.62 BBB.P9.2 BBB.P9.1 | 6.99,8.26 J1.2 | 6.99,15.88 v15.24,15.88 21.59,15.88 21.59,28.57 | 6.99,15.88 v5.08,15.88 | 6.99,15.88 6.99,8.26 | BBB.P9.46 BBB.P9.44 BBB.P9.43 BBB.P9.45 BBB.P9.46 | 21.59,28.57 35.56,28.57 36.2,28.57 38.1,28.57 | BBB.P9.46 75.56,5.71 80.01,10.16 80.01,12.06 80.01,26.67 80.01,34.92 | 80.01,34.92 80.01,44.45 75.88,48.58 67.94,48.58 67.31,47.94 J3.2
GPMC_AD0
  Top 0.254: BBB.P8.25 50.16,49.69 50.8,49.05 55.72,49.05 56.04,48.74 56.04,38.41 U4.97
GPMC_AD1
  Top 0.254: BBB.P8.24 48.9,51.44 48.9,49.21 49.53,48.58 55.24,48.58 55.56,48.26 55.56,38.64 U4.98
GPMC_AD2
  Top 0.254: BBB.P8.5 24.77,45.09 25.08,44.77 35.96,44.77 U4.121
GPMC_AD3
  Top 0.254: BBB.P8.6 26.04,51.44 26.04,45.56 26.35,45.24 36.19,45.24 U4.120
GPMC_AD4
  Top 0.254: BBB.P8.23 47.62,48.74 48.26,48.1 54.77,48.1 55.09,47.78 55.09,38.87 U4.99
GPMC_AD5
  Top 0.254: BBB.P8.22 46.35,51.44 46.35,48.26 46.99,47.62 54.29,47.62 54.61,47.31 54.61,39.1 U4.100
GPMC_AD6
  Top 0.254: BBB.P8.3 22.23,44.13 22.54,43.81 34.79,43.81 U4.124
GPMC_AD7
  Top 0.254: BBB.P8.4 23.5,51.44 23.5,44.61 23.81,44.29 35.02,44.29 U4.123
GPMC_AD8
  Top 0.254: BBB.P8.19 42.55,47.31 43.18,46.67 53.34,46.67 53.66,46.35 53.66,39.56 U4.102
GPMC_AD9
  Top 0.254: BBB.P8.13 34.92,48.9 35.24,48.58 37.78,48.58 40.64,45.72 52.39,45.72 52.7,45.4 52.7,40.73 U4.105
GPMC_AD10
  Top 0.254: BBB.P8.14 36.2,51.44 36.2,49.53 36.67,49.05 37.94,49.05 40.8,46.2 52.86,46.2 53.18,45.88 53.18,40.5 U4.104
GPMC_AD11  (via drill 0.3)
  Top 0.254: v48.9,40.01 48.9,39.37 53.34,34.92 54.67,34.92 U4.94
  Bottom 0.254: v48.9,40.01 48.9,40.32 40.01,49.21 BBB.P8.17
GPMC_AD12
  Top 0.254: BBB.P8.12 33.66,51.44 33.66,48.42 33.97,48.1 37.57,48.1 U4.114
GPMC_AD13
  Top 0.254: BBB.P8.11 32.38,47.94 32.7,47.62 37.34,47.62 U4.115
GPMC_AD14  (via drill 0.3)
  Top 0.254: v48.26,39.37 53.34,34.29 54.75,34.29 U4.93
  Bottom 0.254: v48.26,39.37 38.73,48.9 38.73,51.44 BBB.P8.16
GPMC_AD15  (via drill 0.3)
  Top 0.254: v48.26,38.42 48.58,38.42 53.34,33.66 54.82,33.66 U4.92
  Bottom 0.254: v48.26,38.42 37.47,49.21 BBB.P8.15
GPMC_ADVN
  Top 0.254: BBB.P8.7 27.3,46.04 27.62,45.72 36.42,45.72 U4.119
GPMC_BE0N
  Top 0.254: BBB.P8.9 29.84,46.99 30.16,46.67 36.88,46.67 U4.117
GPMC_BE1N
  Top 0.254: U4.88 56.67,32.68 56.67,32.54 55.88,31.75 55.09,31.75 50.01,26.67 50.01,9.21 50.32,8.89 51.12,8.89 51.44,8.57 51.44,0.95 51.12,0.64 34.29,0.64 33.66,1.27 33.66,3.81 33.02,4.45 BBB.P9.12
GPMC_CLK  (via drill 0.3)
  Top 0.254: U4.95 54.6,35.56 53.34,35.56 49.53,39.37 v49.53,40.64
  Bottom 0.254: v49.53,40.64 41.27,48.9 41.27,51.44 BBB.P8.18
GPMC_CSN1
  Top 0.254: BBB.P8.21 45.09,47.78 45.72,47.15 53.82,47.15 54.13,46.83 54.13,39.33 U4.101
GPMC_OEN
  Top 0.254: BBB.P8.8 28.57,51.44 28.57,46.51 28.89,46.2 36.65,46.2 U4.118
GPMC_WE1N
  Top 0.254: BBB.P8.10 31.11,51.44 31.11,47.47 31.43,47.15 37.11,47.15 U4.116
N$1  (via drill 0.3)
  Top 0.254: U3.1 65.03,34.02 v64.77,34.29
  Bottom 0.254: R1.1 64.77,35.19 v64.77,34.29 64.14,33.66 JP7.1
N$2  (via drill 0.3)
  Top 0.254: U3.2 65.69,34.41 v65.88,34.61
  Bottom 0.254: v65.88,34.61 66.67,34.61 | JP5.1 66.67,34.61 | 66.67,34.61 R3.1
N$3  (via drill 0.3)
  Top 0.254: U3.3 66.33,34.11 66.67,34.45 68.58,34.45 v68.74,34.61
  Bottom 0.254: R101.1 v68.74,34.61 69.22,34.13 JP2.1
N$4
  Top 0.406: D2.A
  Top 1.016: J1.1 D2.A
N$5
  Top 1.016: R2.1 DC1.A
N$6
  Top 0.254: J3.3 R10.1
N$7
  Top 0.254: J3.4 R6.1
N$8
  Top 0.254: J3.5 R7.1
N$9
  Top 0.254: J3.6 R9.1
N$11
  Top 0.254: R13.1 70.06,26.55 D4.A
OSC_FPGA
  Top 0.254: U5.3 60.77,34.66 U4.85
PMOD1_1  (via drill 0.3)
  Top 0.254: v52.07,45.09 46.51,45.09 46.2,44.77 46.2,40.89 U4.112
  Bottom 0.254: v52.07,45.09 52.7,45.72 73.03,45.72 PMOD1.1
PMOD1_2  (via drill 0.3)
  Top 0.254: v51.75,44.29 46.99,44.29 46.67,43.97 46.67,41.12 U4.111
  Bottom 0.254: v51.75,44.29 52.39,44.29 53.34,45.24 72.39,45.24 72.71,44.93 72.71,42.86 73.03,42.55 PMOD1.2
PMOD1_3
  Top 0.254: 61.6,24.12 U4.67 62.18,23.5 69.53,23.5 69.85,23.81 69.85,25.24 70.17,25.56 70.96,25.56 71.28,25.88 71.28,38.89 72.39,40.01 PMOD1.3
PMOD1_4
  Top 0.254: PMOD1.4 72.07,37.47 71.75,37.15 71.75,25.4 71.44,25.08 70.64,25.08 70.33,24.77 70.33,23.34 70.01,23.02 61.95,23.02 U4.66
PMOD1_7
  Top 0.254: PMOD1.7 74.61,43.5 74.61,36.83 74.3,36.51 72.55,36.51 72.23,36.2 72.23,24.92 71.91,24.61 71.12,24.61 70.8,24.29 70.8,21.27 70.48,20.95 61.18,20.95 U4.62
PMOD1_8
  Top 0.254: PMOD1.8 75.56,42.55 75.09,42.07 75.09,36.51 74.45,35.88 73.03,35.88 72.71,35.56 72.71,24.45 72.39,24.13 71.6,24.13 71.28,23.81 71.28,20.8 70.96,20.48 60.95,20.48 U4.61
PMOD1_9  (via drill 0.3)
  Top 0.254: U4.58 59.31,20 71.44,20 71.75,20.32 71.75,23.34 72.07,23.65 72.87,23.65 73.18,23.97 73.18,31.11 73.5,31.43 76.83,31.43 77.47,32.07 v77.47,36.67
  Bottom 0.254: v77.47,36.67 77.47,39.37 76.83,40.01 PMOD1.9
PMOD1_10
  Top 0.254: U4.57 59.08,19.53 71.91,19.53 72.23,19.84 72.23,22.86 72.55,23.18 73.34,23.18 73.66,23.5 73.66,30.64 73.98,30.96 77.63,30.96 78.11,31.43 78.11,37.15 77.79,37.47 PMOD1.10
PMOD2_1
  Top 0.254: PMOD2.1 73.34,22.23 72.71,21.59 72.71,19.37 72.39,19.05 58.85,19.05 U4.56
PMOD2_2
  Top 0.254: PMOD2.2 72.55,18.57 58.62,18.57 U4.55
PMOD2_3
  Top 0.254: PMOD2.3 73.03,16.51 55.73,16.51 U4.48
PMOD2_4
  Top 0.254: PMOD2.4 73.66,15.72 73.34,16.03 55.5,16.03 U4.47
PMOD2_7
  Top 0.254: PMOD2.7 75.56,22.23 74.61,21.27 74.61,13.97 74.3,13.65 73.03,13.65 72.71,13.97 72.71,15.24 72.39,15.56 55.27,15.56 U4.46
PMOD2_8
  Top 0.254: PMOD2.8 75.56,19.68 75.25,19.37 75.25,13.65 74.77,13.18 72.55,13.18 72.23,13.49 72.23,14.76 71.91,15.08 55.04,15.08 U4.45
PMOD2_9
  Top 0.254: PMOD2.9 77.15,16.19 77.15,11.59 76.68,11.11 72.23,11.11 71.75,11.59 71.75,14.29 71.44,14.61 54.8,14.61 U4.44
PMOD2_10  (via drill 0.3)
  Top 0.254: v70.96,13.81 70.64,14.13 54.58,14.13 U4.43
  Bottom 0.254: PMOD2.10 75.25,13.65 71.12,13.65 v70.96,13.81
SUSPEND
  Top 0.254: R12.2 63.5,30.16 63.98,29.69 63.98,29.38 U4.73
TCK  (via drill 0.3)
  Top 0.254: R10.2 64.77,42.7 v63.66,42.7 | v51.75,42.7 47.94,42.7 47.62,42.39 47.62,41.58 U4.109
  Bottom 0.254: v63.66,42.7 v51.75,42.7
TDI  (via drill 0.3)
  Top 0.254: R7.2 59.69,43.5 59.37,43.81 v58.42,43.81 | v52.07,43.5 47.47,43.5 47.15,43.18 47.15,41.35 U4.110
  Bottom 0.254: v58.42,43.81 52.39,43.81 v52.07,43.5
TDO  (via drill 0.3)
  Top 0.254: R6.2 v62.23,41.27 | v50.8,39.21 50.8,39.53 51.12,39.85 U4.106
  Bottom 0.254: v62.23,41.27 52.86,41.27 v50.8,39.21
TMS  (via drill 0.3)
  Top 0.254: R9.2 v57.15,41.91 | v52.07,41.91 52.07,41.51 U4.107
  Bottom 0.254: v57.15,41.91 v52.07,41.91
VIN_5V
  Top 1.016: 5.71,10.95 5.08,11.59 C1.2 4.98,12.38 3.49,12.38 P3.1 | 5.71,10.95 7.62,10.95 | 7.62,10.95 12.06,10.95 12.46,11.35 U1.3 | 5.71,10.95 D2.C | D1.C 7.62,10.95

### Text on the board
tNames: FPGA Cape | Rev. 1.0